# EAGLE schematic ControlBoard00_v04_NewNetNamesNewBackplanes (EAGLE 7.7.0), part 1 of 2

## Sheet 1 of 9: RPi Zero 2 W
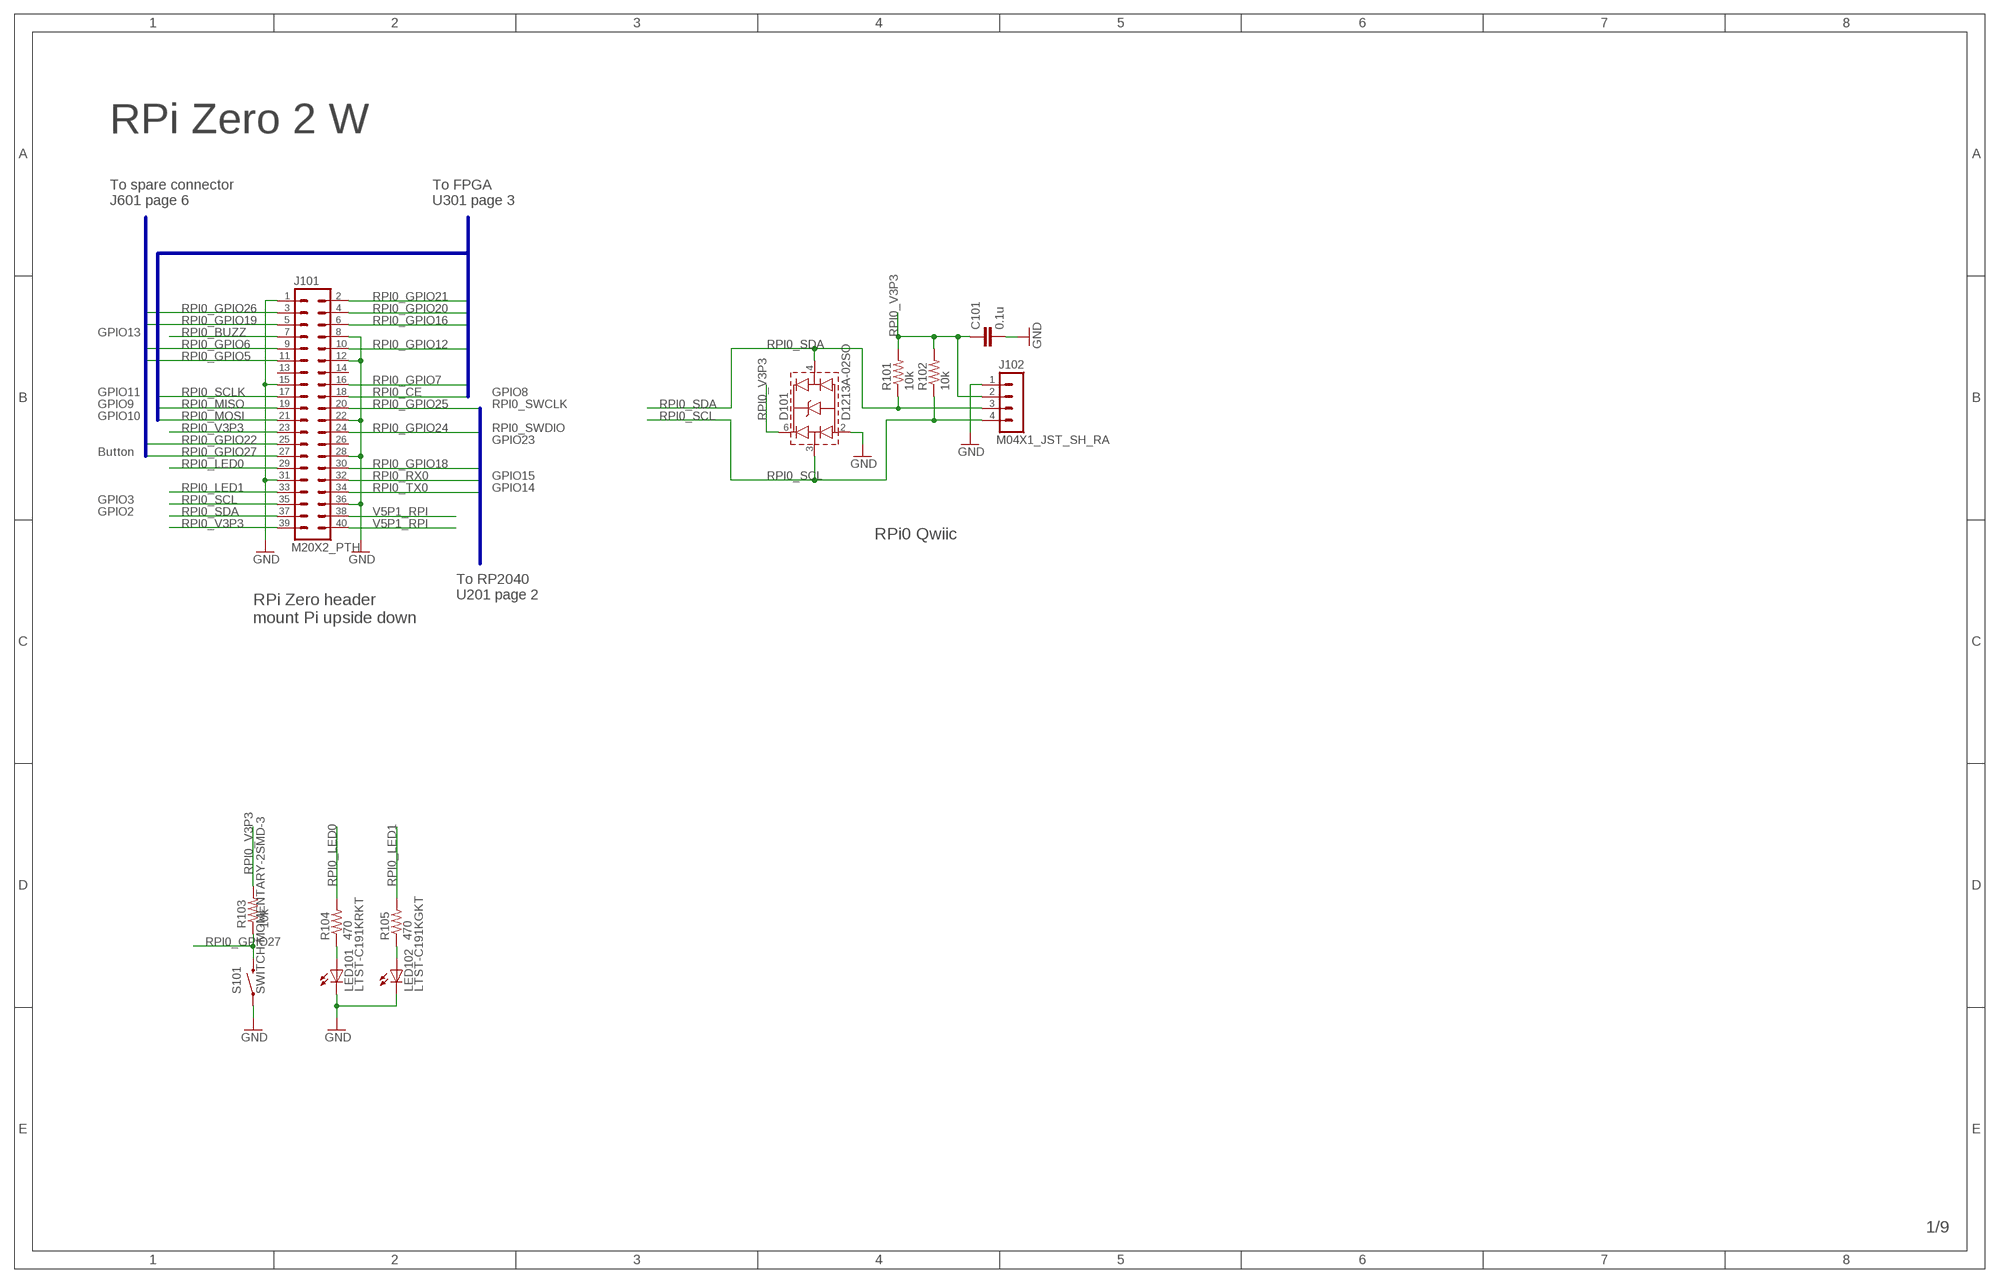
[diagram p0: schematic, sheet 1]

### Parts
C101  0.1u  CAP0402-CAP  [0402-CAP]
D101  D1213A-02SO  [SOT23-6]
J101  M20X2_PTH  [M20X2_PTH]
J102  M04X1_JST_SH_RA  [M04X1_JST_SH_SM_RA]
LED101  LTST-C191KRKT  LED0603  [LED-0603]
LED102  LTST-C191KGKT  LED0603  [LED-0603]
R101  10k  RESISTOR0402-RES  [0402-RES]
R102  10k  RESISTOR0402-RES  [0402-RES]
R103  10k  RESISTOR0402-RES  [0402-RES]
R104  470  RESISTOR0402-RES  [0402-RES]
R105  470  RESISTOR0402-RES  [0402-RES]
S101  SWITCH-MOMENTARY-2SMD-3  [TACTILE_SWITCH_SMD-3]

### Nets
GND: C101.2 D101.2(VN) J101.1 J101.8 J101.12 J101.15 J101.22 J101.28 J101.31 J101.36 J102.1 LED101.C LED102.C S101.1 ; also sheet 2,3,4,5,6,7,8,9
N$86: LED101.A R104.1
N$88: LED102.A R105.1
RPI0_BUZZ: J101.7 ; also sheet 6
RPI0_CE: J101.18 ; also sheet 3
RPI0_GPIO5: J101.11 ; also sheet 6
RPI0_GPIO6: J101.9 ; also sheet 6
RPI0_GPIO7: J101.16 ; also sheet 3
RPI0_GPIO12: J101.10 ; also sheet 3
RPI0_GPIO16: J101.6 ; also sheet 3
RPI0_GPIO18: J101.30 ; also sheet 2
RPI0_GPIO19: J101.5 ; also sheet 6
RPI0_GPIO20: J101.4 ; also sheet 3
RPI0_GPIO21: J101.2 ; also sheet 3
RPI0_GPIO22: J101.25 ; also sheet 6
RPI0_GPIO24: J101.24 ; also sheet 2
RPI0_GPIO25: J101.20 ; also sheet 2
RPI0_GPIO26: J101.3 ; also sheet 6
RPI0_GPIO27: J101.27 R103.1 S101.4 ; also sheet 6
RPI0_LED0: J101.29 R104.2
RPI0_LED1: J101.33 R105.2
RPI0_MISO: J101.19 ; also sheet 3
RPI0_MOSI: J101.21 ; also sheet 3
RPI0_RX0: J101.32 ; also sheet 2
RPI0_SCL: D101.3(CH1) J101.35 J102.4 R102.1 ; also sheet 3
RPI0_SCLK: J101.17 ; also sheet 3
RPI0_SDA: D101.4(CH2) J101.37 J102.3 R101.1 ; also sheet 3
RPI0_TX0: J101.34 ; also sheet 2
RPI0_V3P3: C101.1 D101.6(VP) J101.23 J101.39 J102.2 R101.2 R102.2 R103.2
V5P1_RPI: J101.38 J101.40 ; also sheet 7
Unconnected: J101.13 J101.14 J101.26

### Buses
RPI0_GPIO7,RPI0_GPIO12,RPI0_GPIO16,RPI0_GPIO20,RPI0_GPIO21,RPI0_SCLK,RPI0_MISO,RPI0_MOSI,RPI0_CE
RPI0_GPIO18,RPI0_GPIO24,RPI0_GPIO25,RPI0_RX0,RPI0_TX0
RPI0_GPIO5,RPI0_GPIO6,RPI0_GPIO19,RPI0_GPIO22,RPI0_GPIO26,RPI0_GPIO27

### Notes on the sheet
- RPi Zero 2 W
- To spare connector
  J601 page 6
- To FPGA
  U301 page 3
- GPIO13
- GPIO11 | GPIO8
- GPIO9 | RPI0_SWCLK
- GPIO10
- RPI0_SWDIO
- GPIO23
- Button
- GPIO15
- GPIO14
- GPIO3
- GPIO2
- RPi0 Qwiic
- To RP2040
  U201 page 2
- RPi Zero header
  mount Pi upside down

## Sheet 2 of 9: RP2040 MCU
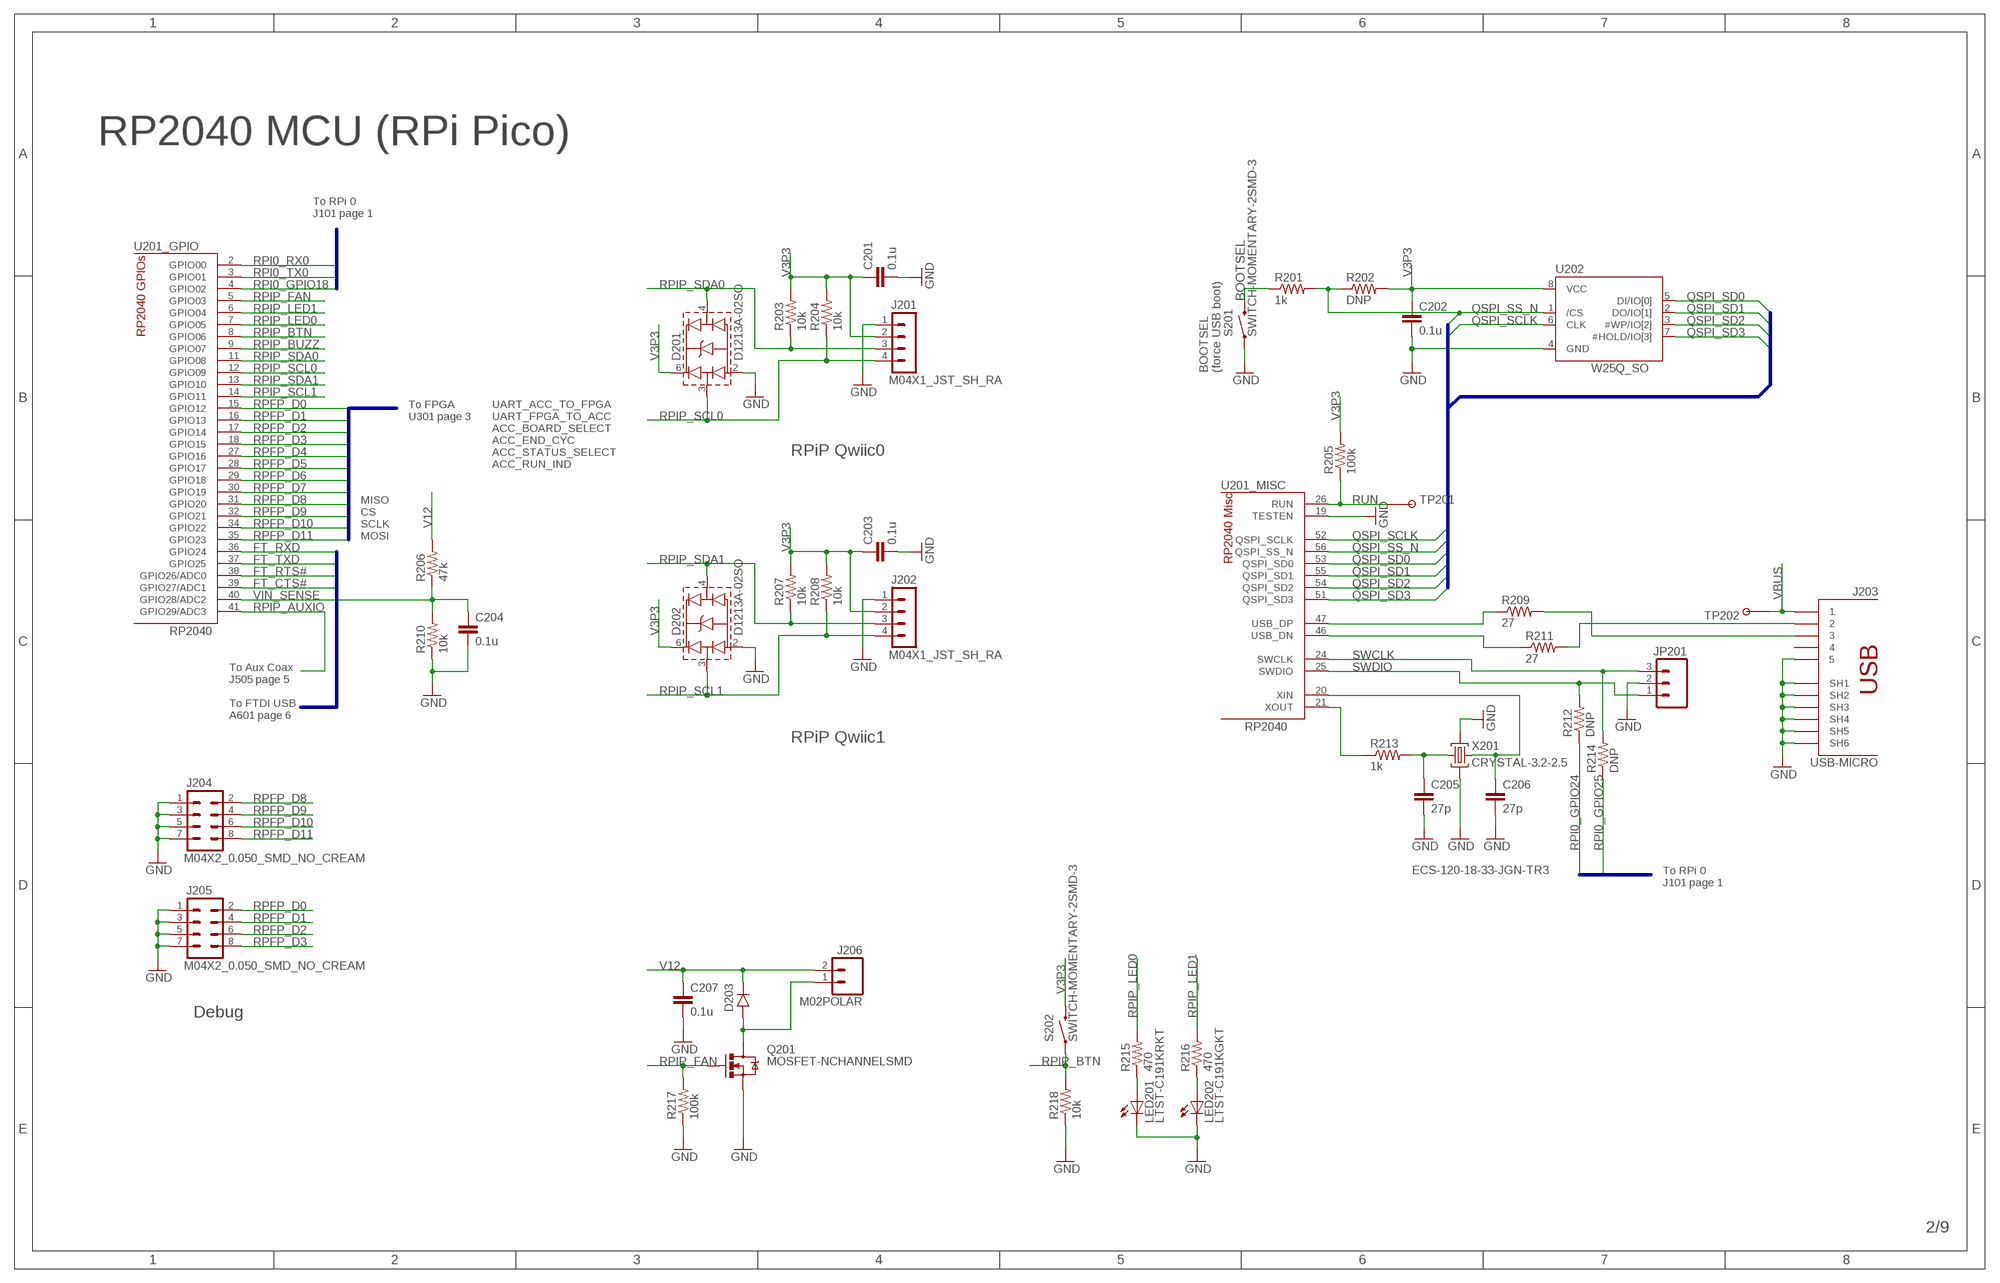
[diagram p1: schematic, sheet 2]

### Parts
C201  0.1u  CAP0402-CAP  [0402-CAP]
C202  0.1u  CAP0402-CAP  [0402-CAP]
C203  0.1u  CAP0402-CAP  [0402-CAP]
C204  0.1u  CAP0402-CAP  [0402-CAP]
C205  27p  CAP0402-CAP  [0402-CAP]
C206  27p  CAP0402-CAP  [0402-CAP]
C207  0.1u  CAP0402-CAP  [0402-CAP]
D201  D1213A-02SO  [SOT23-6]
D202  D1213A-02SO  [SOT23-6]
D203  DIODESOD123  [SOD123]
J201  M04X1_JST_SH_RA  [M04X1_JST_SH_SM_RA]
J202  M04X1_JST_SH_RA  [M04X1_JST_SH_SM_RA]
J203  USB-MICRO  [USB-MICRO]
J204  M04X2_0.050_SMD_NO_CREAM  [M04X2_0.050_SMD_NO_CREAM]
J205  M04X2_0.050_SMD_NO_CREAM  [M04X2_0.050_SMD_NO_CREAM]
J206  M02POLAR  [MOLEX-1X2]
JP201  M03POLAR  [MOLEX-1X3]
LED201  LTST-C191KRKT  LED0603  [LED-0603]
LED202  LTST-C191KGKT  LED0603  [LED-0603]
Q201  MOSFET-NCHANNELSMD  [SOT23-3]
R201  1k  RESISTOR0402-RES  [0402-RES]
R202  DNP  RESISTOR0402-RES  [0402-RES]
R203  10k  RESISTOR0402-RES  [0402-RES]
R204  10k  RESISTOR0402-RES  [0402-RES]
R205  100k  RESISTOR0402-RES  [0402-RES]
R206  47k  RESISTOR0402-RES  [0402-RES]
R207  10k  RESISTOR0402-RES  [0402-RES]
R208  10k  RESISTOR0402-RES  [0402-RES]
R209  27  RESISTOR0402-RES  [0402-RES]
R210  10k  RESISTOR0402-RES  [0402-RES]
R211  27  RESISTOR0402-RES  [0402-RES]
R212  DNP  RESISTOR0402-RES  [0402-RES]
R213  1k  RESISTOR0402-RES  [0402-RES]
R214  DNP  RESISTOR0402-RES  [0402-RES]
R215  470  RESISTOR0402-RES  [0402-RES]
R216  470  RESISTOR0402-RES  [0402-RES]
R217  100k  RESISTOR0402-RES  [0402-RES]
R218  10k  RESISTOR0402-RES  [0402-RES]
S201  SWITCH-MOMENTARY-2SMD-3  [TACTILE_SWITCH_SMD-3]
S202  SWITCH-MOMENTARY-2SMD-3  [TACTILE_SWITCH_SMD-3]
TP201  TESTPOINT_ROUND  [TESTPAD_ROUND]
TP202  TESTPOINT_ROUND  [TESTPAD_ROUND]
U201  RP2040  [QFN-56_EP]
U202  W25Q_SO  [SO08-208MIL]
X201  CRYSTAL-3.2-2.5  [CRYSTAL-3.2-2.5]

### Nets
BOOTSEL: R201.1 S201.4
FT_CTS#: U201.39(_GPIO:GPIO27/ADC1) ; also sheet 6
FT_RTS#: U201.38(_GPIO:GPIO26/ADC0) ; also sheet 6
FT_RXD: U201.36(_GPIO:GPIO24) ; also sheet 6
FT_TXD: U201.37(_GPIO:GPIO25) ; also sheet 6
GND: C201.2 C202.2 C203.2 C204.2 C205.2 C206.2 C207.2 D201.2(VN) D202.2(VN) J201.1 J202.1 J203.5 J203.SH1 J203.SH2 J203.SH3 J203.SH4 J203.SH5 J203.SH6 J204.1 J204.3 J204.5 J204.7 J205.1 J205.3 J205.5 J205.7 JP201.2 LED201.C LED202.C Q201.2(S) R210.1 R217.1 R218.1 S201.1 U201.19(_MISC:TESTEN) U202.4(GND) X201.2(GND) X201.4(GND) ; also sheet 1,3,4,5,6,7,8,9
N$16: C206.1 U201.20(_MISC:XIN) X201.3(C2)
N$17: C205.1 R213.2 X201.1(C1)
N$18: R213.1 U201.21(_MISC:XOUT)
N$29: R209.1 U201.47(_MISC:USB_DP)
N$30: R211.1 U201.46(_MISC:USB_DN)
N$35: J203.2 R211.2
N$37: J203.3 R209.2
N$85: LED202.A R216.1
N$91: LED201.A R215.1
N$92: D203.A J206.1 Q201.3(D)
QSPI_SCLK: U201.52(_MISC:QSPI_SCLK) U202.6(CLK)
QSPI_SD0: U201.53(_MISC:QSPI_SD0) U202.5(DI/IO[0])
QSPI_SD1: U201.55(_MISC:QSPI_SD1) U202.2(DO/IO[1])
QSPI_SD2: U201.54(_MISC:QSPI_SD2) U202.3(#WP/IO[2])
QSPI_SD3: U201.51(_MISC:QSPI_SD3) U202.7(#HOLD/IO[3])
QSPI_SS_N: R201.2 R202.1 U201.56(_MISC:QSPI_SS_N) U202.1(/CS)
RPFP_D0: J205.2 U201.15(_GPIO:GPIO12) ; also sheet 3
RPFP_D1: J205.4 U201.16(_GPIO:GPIO13) ; also sheet 3
RPFP_D2: J205.6 U201.17(_GPIO:GPIO14) ; also sheet 3
RPFP_D3: J205.8 U201.18(_GPIO:GPIO15) ; also sheet 3
RPFP_D4: U201.27(_GPIO:GPIO16) ; also sheet 3
RPFP_D5: U201.28(_GPIO:GPIO17) ; also sheet 3
RPFP_D6: U201.29(_GPIO:GPIO18) ; also sheet 3
RPFP_D7: U201.30(_GPIO:GPIO19) ; also sheet 3
RPFP_D8: J204.2 U201.31(_GPIO:GPIO20) ; also sheet 3
RPFP_D9: J204.4 U201.32(_GPIO:GPIO21) ; also sheet 3
RPFP_D10: J204.6 U201.34(_GPIO:GPIO22) ; also sheet 3
RPFP_D11: J204.8 U201.35(_GPIO:GPIO23) ; also sheet 3
RPI0_GPIO18: U201.4(_GPIO:GPIO02) ; also sheet 1
RPI0_GPIO24: R212.1 ; also sheet 1
RPI0_GPIO25: R214.1 ; also sheet 1
RPI0_RX0: U201.2(_GPIO:GPIO00) ; also sheet 1
RPI0_TX0: U201.3(_GPIO:GPIO01) ; also sheet 1
RPIP_AUXIO: U201.41(_GPIO:GPIO29/ADC3) ; also sheet 5
RPIP_BTN: R218.2 S202.1 U201.8(_GPIO:GPIO06)
RPIP_BUZZ: U201.9(_GPIO:GPIO07) ; also sheet 6
RPIP_FAN: Q201.1(G) R217.2 U201.5(_GPIO:GPIO03)
RPIP_LED0: R215.2 U201.7(_GPIO:GPIO05)
RPIP_LED1: R216.2 U201.6(_GPIO:GPIO04)
RPIP_SCL0: D201.3(CH1) J201.4 R204.1 U201.12(_GPIO:GPIO09)
RPIP_SCL1: D202.3(CH1) J202.4 R208.1 U201.14(_GPIO:GPIO11) ; also sheet 6
RPIP_SDA0: D201.4(CH2) J201.3 R203.1 U201.11(_GPIO:GPIO08)
RPIP_SDA1: D202.4(CH2) J202.3 R207.1 U201.13(_GPIO:GPIO10) ; also sheet 6
RUN: R205.1 TP201.P$1 U201.26(_MISC:RUN)
SWCLK: JP201.3 R214.2 U201.24(_MISC:SWCLK)
SWDIO: JP201.1 R212.2 U201.25(_MISC:SWDIO)
V3P3: C201.1 C202.1 C203.1 D201.6(VP) D202.6(VP) J201.2 J202.2 R202.2 R203.2 R204.2 R205.2 R207.2 R208.2 S202.4 U202.8(VCC) ; also sheet 3,5,6,7,9
V12: C207.1 D203.C J206.2 R206.2 ; also sheet 6,7,8,9
VBUS: J203.1 TP202.P$1
VIN_SENSE: C204.1 R206.1 R210.2 U201.40(_GPIO:GPIO28/ADC2) ; also sheet 5
Unconnected: J203.4

### Buses
QSPI_SCLK,QSPI_SS_N,QSPI_SD[0..3]
RPI0_GPIO18,RPI0_GPIO24,RPI0_GPIO25,RPI0_RX0,RPI0_TX0
RPIP_GPIO[12..19],RPIP_MISO0,RPIP_MOSI0,RPIP_SCLK0,RPIP_CS0
FT_TXD,FT_RTS#,FT_CTS#,FT_RXD

### Notes on the sheet
- RP2040 MCU (RPi Pico)
- To RPi 0
  J101 page 1
- BOOTSEL
  (force USB boot)
- UART_ACC_TO_FPGA
- To FPGA
  U301 page 3
- UART_FPGA_TO_ACC
- ACC_BOARD_SELECT
- ACC_END_CYC
- ACC_STATUS_SELECT | RPiP Qwiic0
- ACC_RUN_IND
- MISO
- CS
- SCLK
- MOSI
- To Aux Coax
  J505 page 5
- To FTDI USB
  A601 page 6
- RPiP Qwiic1
- ECS-120-18-33-JGN-TR3
- To RPi 0
  J101 page 1
- Debug

## Sheet 3 of 9: FPGA
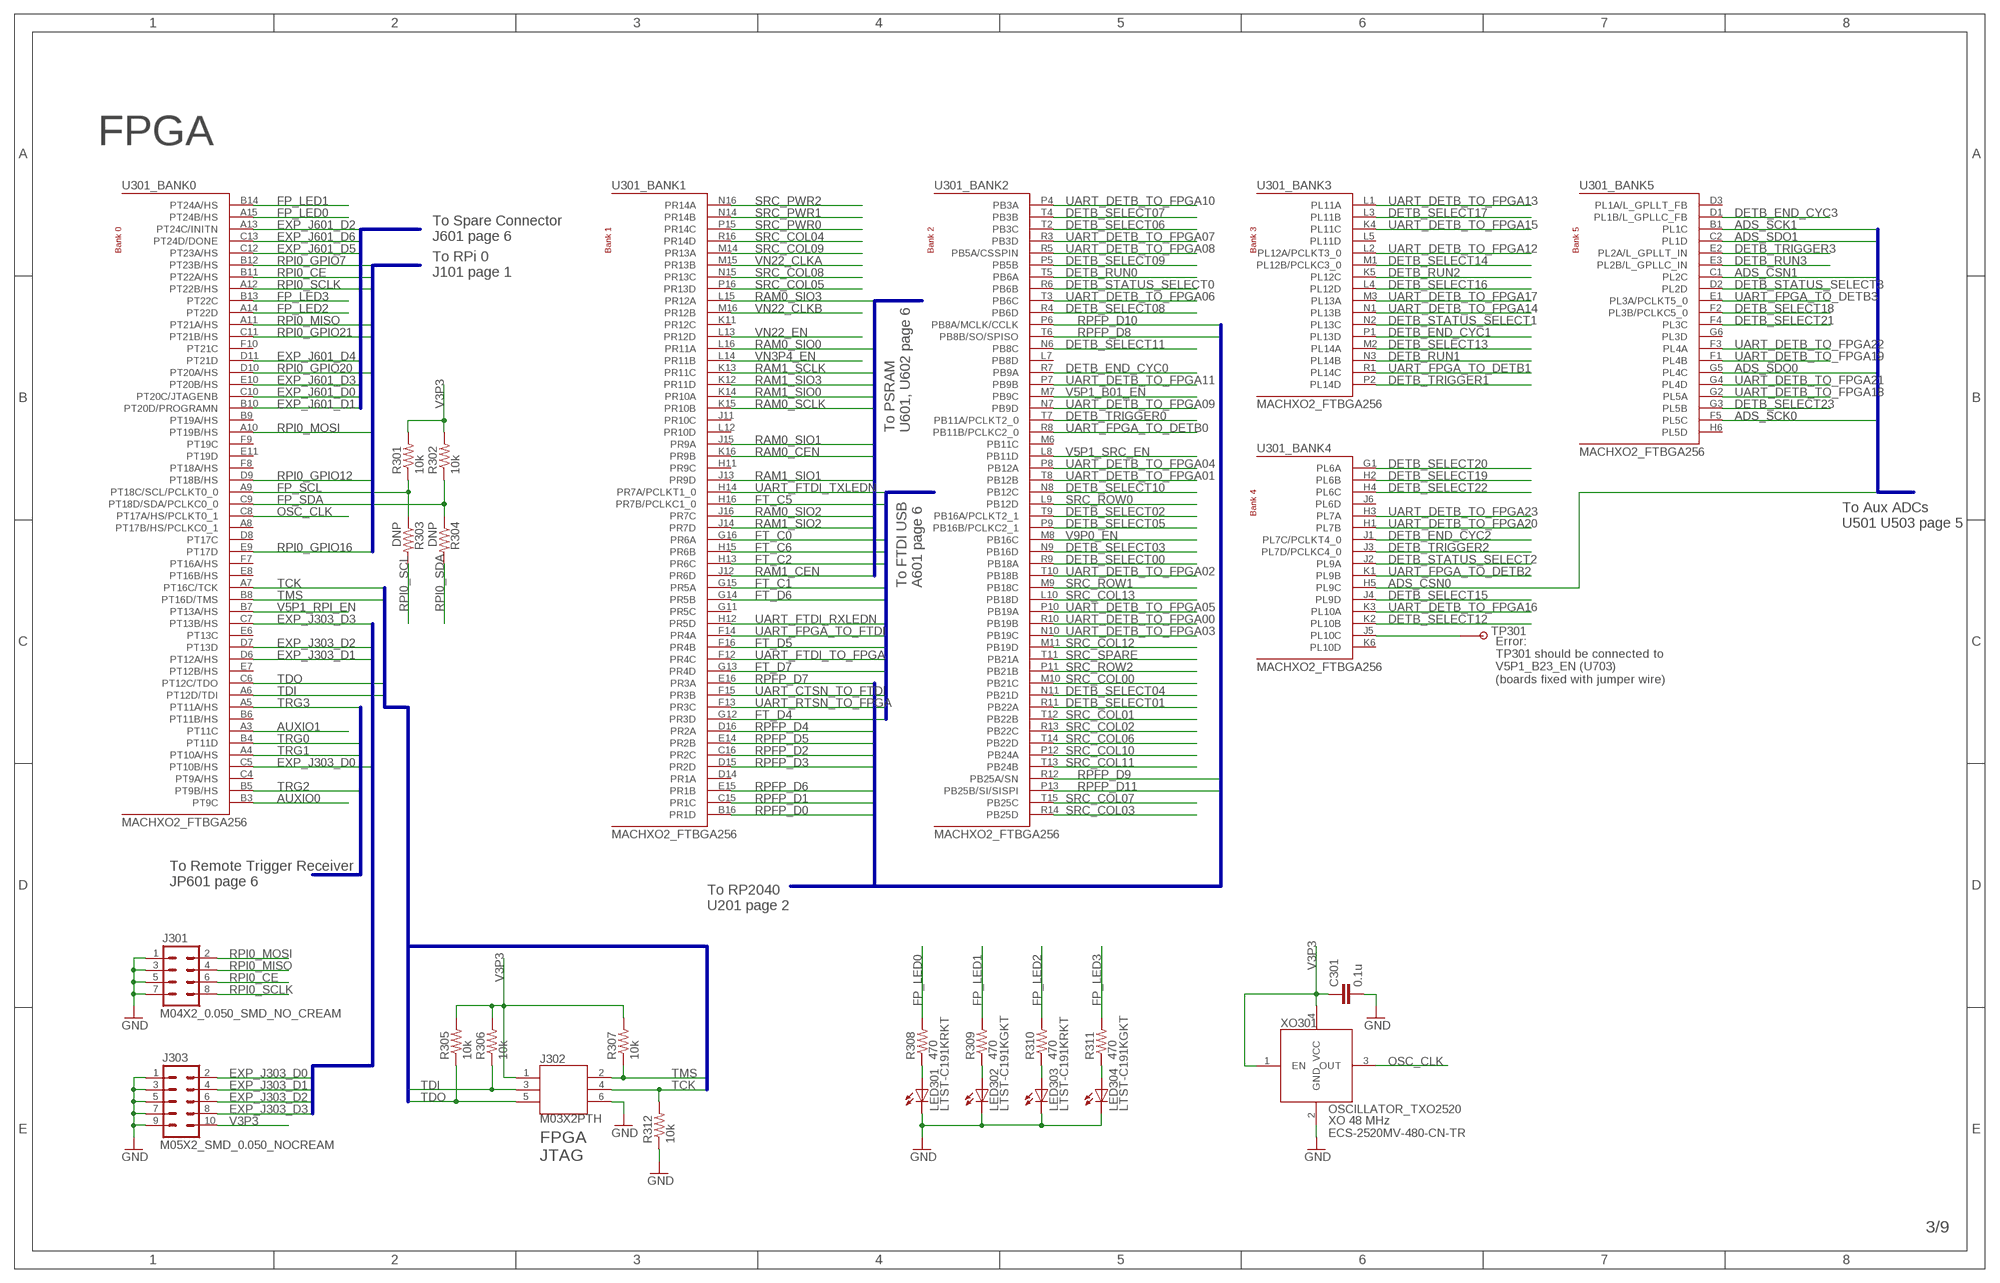
[diagram p2: schematic, sheet 3]

### Parts
C301  0.1u  CAP0402-CAP  [0402-CAP]
J301  M04X2_0.050_SMD_NO_CREAM  [M04X2_0.050_SMD_NO_CREAM]
J302  M03X2PTH  [2X3-NS]
J303  M05X2_SMD_0.050_NOCREAM  [M05X2_0.050_SMD_NO_CREAM]
LED301  LTST-C191KRKT  LED0603  [LED-0603]
LED302  LTST-C191KGKT  LED0603  [LED-0603]
LED303  LTST-C191KRKT  LED0603  [LED-0603]
LED304  LTST-C191KGKT  LED0603  [LED-0603]
R301  10k  RESISTOR0402-RES  [0402-RES]
R302  10k  RESISTOR0402-RES  [0402-RES]
R303  DNP  RESISTOR0402-RES  [0402-RES]
R304  DNP  RESISTOR0402-RES  [0402-RES]
R305  10k  RESISTOR0402-RES  [0402-RES]
R306  10k  RESISTOR0402-RES  [0402-RES]
R307  10k  RESISTOR0402-RES  [0402-RES]
R308  470  RESISTOR0402-RES  [0402-RES]
R309  470  RESISTOR0402-RES  [0402-RES]
R310  470  RESISTOR0402-RES  [0402-RES]
R311  470  RESISTOR0402-RES  [0402-RES]
R312  10k  RESISTOR0402-RES  [0402-RES]
TP301  TESTPOINT_ROUND  [TESTPAD_ROUND]
U301  MACHXO2_FTBGA256  [LBGA-256]
XO301  OSCILLATOR_TXO2520  [TXO2520]

### Nets
ADS_CSN0: U301.H5(_BANK4:PL9C) ; also sheet 5
ADS_CSN1: U301.C1(_BANK5:PL2C) ; also sheet 5
ADS_SCK0: U301.F5(_BANK5:PL5C) ; also sheet 5
ADS_SCK1: U301.B1(_BANK5:PL1C) ; also sheet 5
ADS_SDO0: U301.G5(_BANK5:PL4C) ; also sheet 5
ADS_SDO1: U301.C2(_BANK5:PL1D) ; also sheet 5
AUXIO0: U301.B3(_BANK0:PT9C) ; also sheet 5
AUXIO1: U301.A3(_BANK0:PT11C) ; also sheet 5
DETB_END_CYC0: U301.R7(_BANK2:PB9A) ; also sheet 4
DETB_END_CYC1: U301.P1(_BANK3:PL13D) ; also sheet 4
DETB_END_CYC2: U301.J1(_BANK4:PL7C/PCLKT4_0) ; also sheet 4
DETB_END_CYC3: U301.D1(_BANK5:PL1B/L_GPLLC_FB) ; also sheet 4
DETB_RUN0: U301.T5(_BANK2:PB6A) ; also sheet 4
DETB_RUN1: U301.N3(_BANK3:PL14B) ; also sheet 4
DETB_RUN2: U301.K5(_BANK3:PL12C) ; also sheet 4
DETB_RUN3: U301.E3(_BANK5:PL2B/L_GPLLC_IN) ; also sheet 4
DETB_SELECT00: U301.R9(_BANK2:PB18A) ; also sheet 4
DETB_SELECT01: U301.R11(_BANK2:PB22A) ; also sheet 4
DETB_SELECT02: U301.T9(_BANK2:PB16A/PCLKT2_1) ; also sheet 4
DETB_SELECT03: U301.N9(_BANK2:PB16D) ; also sheet 4
DETB_SELECT04: U301.N11(_BANK2:PB21D) ; also sheet 4
DETB_SELECT05: U301.P9(_BANK2:PB16B/PCLKC2_1) ; also sheet 4
DETB_SELECT06: U301.T2(_BANK2:PB3C) ; also sheet 4
DETB_SELECT07: U301.T4(_BANK2:PB3B) ; also sheet 4
DETB_SELECT08: U301.R4(_BANK2:PB6D) ; also sheet 4
DETB_SELECT09: U301.P5(_BANK2:PB5B) ; also sheet 4
DETB_SELECT10: U301.N8(_BANK2:PB12C) ; also sheet 4
DETB_SELECT11: U301.N6(_BANK2:PB8C) ; also sheet 4
DETB_SELECT12: U301.K2(_BANK4:PL10B) ; also sheet 4
DETB_SELECT13: U301.M2(_BANK3:PL14A) ; also sheet 4
DETB_SELECT14: U301.M1(_BANK3:PL12B/PCLKC3_0) ; also sheet 4
DETB_SELECT15: U301.J4(_BANK4:PL9D) ; also sheet 4
DETB_SELECT16: U301.L4(_BANK3:PL12D) ; also sheet 4
DETB_SELECT17: U301.L3(_BANK3:PL11B) ; also sheet 4
DETB_SELECT18: U301.F2(_BANK5:PL3B/PCLKC5_0) ; also sheet 4
DETB_SELECT19: U301.H2(_BANK4:PL6B) ; also sheet 4
DETB_SELECT20: U301.G1(_BANK4:PL6A) ; also sheet 4
DETB_SELECT21: U301.F4(_BANK5:PL3C) ; also sheet 4
DETB_SELECT22: U301.H4(_BANK4:PL6C) ; also sheet 4
DETB_SELECT23: U301.G3(_BANK5:PL5B) ; also sheet 4
DETB_STATUS_SELECT0: U301.R6(_BANK2:PB6B) ; also sheet 4
DETB_STATUS_SELECT1: U301.N2(_BANK3:PL13C) ; also sheet 4
DETB_STATUS_SELECT2: U301.J2(_BANK4:PL9A) ; also sheet 4
DETB_STATUS_SELECT3: U301.D2(_BANK5:PL2D) ; also sheet 4
DETB_TRIGGER0: U301.T7(_BANK2:PB11A/PCLKT2_0) ; also sheet 4
DETB_TRIGGER1: U301.P2(_BANK3:PL14D) ; also sheet 4
DETB_TRIGGER2: U301.J3(_BANK4:PL7D/PCLKC4_0) ; also sheet 4
DETB_TRIGGER3: U301.E2(_BANK5:PL2A/L_GPLLT_IN) ; also sheet 4
EXP_J303_D0: J303.2 U301.C5(_BANK0:PT10B/HS)
EXP_J303_D1: J303.4 U301.D6(_BANK0:PT12A/HS)
EXP_J303_D2: J303.6 U301.D7(_BANK0:PT13D)
EXP_J303_D3: J303.8 U301.C7(_BANK0:PT13B/HS)
EXP_J601_D0: U301.C10(_BANK0:PT20C/JTAGENB) ; also sheet 6
EXP_J601_D1: U301.B10(_BANK0:PT20D/PROGRAMN) ; also sheet 6
EXP_J601_D2: U301.A13(_BANK0:PT24C/INITN) ; also sheet 6
EXP_J601_D3: U301.E10(_BANK0:PT20B/HS) ; also sheet 6
EXP_J601_D4: U301.D11(_BANK0:PT21D) ; also sheet 6
EXP_J601_D5: U301.C12(_BANK0:PT23A/HS) ; also sheet 6
EXP_J601_D6: U301.C13(_BANK0:PT24D/DONE) ; also sheet 6
FP_LED0: R308.2 U301.A15(_BANK0:PT24B/HS)
FP_LED1: R309.2 U301.B14(_BANK0:PT24A/HS)
FP_LED2: R310.2 U301.A14(_BANK0:PT22D)
FP_LED3: R311.2 U301.B13(_BANK0:PT22C)
FP_SCL: R301.1 R303.1 U301.A9(_BANK0:PT18C/SCL/PCLKT0_0)
FP_SDA: R302.1 R304.1 U301.C9(_BANK0:PT18D/SDA/PCLKC0_0)
FT_C0: U301.G16(_BANK1:PR6A) ; also sheet 6
FT_C1: U301.G15(_BANK1:PR5A) ; also sheet 6
FT_C2: U301.H13(_BANK1:PR6C) ; also sheet 6
FT_C5: U301.H16(_BANK1:PR7B/PCLKC1_0) ; also sheet 6
FT_C6: U301.H15(_BANK1:PR6B) ; also sheet 6
FT_D4: U301.G12(_BANK1:PR3D) ; also sheet 6
FT_D5: U301.F16(_BANK1:PR4B) ; also sheet 6
FT_D6: U301.G14(_BANK1:PR5B) ; also sheet 6
FT_D7: U301.G13(_BANK1:PR4D) ; also sheet 6
GND: C301.2 J301.1 J301.3 J301.5 J301.7 J302.6 J303.1 J303.3 J303.5 J303.7 J303.9 LED301.C LED302.C LED303.C LED304.C R312.1 XO301.2(GND) ; also sheet 1,2,4,5,6,7,8,9
N$55: LED301.A R308.1
N$56: LED302.A R309.1
N$57: LED303.A R310.1
N$58: LED304.A R311.1
OSC_CLK: U301.C8(_BANK0:PT17A/HS/PCLKT0_1) XO301.3(OUT)
RAM0_CEN: U301.K16(_BANK1:PR9B) ; also sheet 6
RAM0_SCLK: U301.K15(_BANK1:PR10B) ; also sheet 6
RAM0_SIO0: U301.L16(_BANK1:PR11A) ; also sheet 6
RAM0_SIO1: U301.J15(_BANK1:PR9A) ; also sheet 6
RAM0_SIO2: U301.J16(_BANK1:PR7C) ; also sheet 6
RAM0_SIO3: U301.L15(_BANK1:PR12A) ; also sheet 6
RAM1_CEN: U301.J12(_BANK1:PR6D) ; also sheet 6
RAM1_SCLK: U301.K13(_BANK1:PR11C) ; also sheet 6
RAM1_SIO0: U301.K14(_BANK1:PR10A) ; also sheet 6
RAM1_SIO1: U301.J13(_BANK1:PR9D) ; also sheet 6
RAM1_SIO2: U301.J14(_BANK1:PR7D) ; also sheet 6
RAM1_SIO3: U301.K12(_BANK1:PR11D) ; also sheet 6
RPFP_D0: U301.B16(_BANK1:PR1D) ; also sheet 2
RPFP_D1: U301.C15(_BANK1:PR1C) ; also sheet 2
RPFP_D2: U301.C16(_BANK1:PR2C) ; also sheet 2
RPFP_D3: U301.D15(_BANK1:PR2D) ; also sheet 2
RPFP_D4: U301.D16(_BANK1:PR2A) ; also sheet 2
RPFP_D5: U301.E14(_BANK1:PR2B) ; also sheet 2
RPFP_D6: U301.E15(_BANK1:PR1B) ; also sheet 2
RPFP_D7: U301.E16(_BANK1:PR3A) ; also sheet 2
RPFP_D8: U301.T6(_BANK2:PB8B/SO/SPISO) ; also sheet 2
RPFP_D9: U301.R12(_BANK2:PB25A/SN) ; also sheet 2
RPFP_D10: U301.P6(_BANK2:PB8A/MCLK/CCLK) ; also sheet 2
RPFP_D11: U301.P13(_BANK2:PB25B/SI/SISPI) ; also sheet 2
RPI0_CE: J301.6 U301.B11(_BANK0:PT22A/HS) ; also sheet 1
RPI0_GPIO7: U301.B12(_BANK0:PT23B/HS) ; also sheet 1
RPI0_GPIO12: U301.D9(_BANK0:PT18B/HS) ; also sheet 1
RPI0_GPIO16: U301.E9(_BANK0:PT17D) ; also sheet 1
RPI0_GPIO20: U301.D10(_BANK0:PT20A/HS) ; also sheet 1
RPI0_GPIO21: U301.C11(_BANK0:PT21B/HS) ; also sheet 1
RPI0_MISO: J301.4 U301.A11(_BANK0:PT21A/HS) ; also sheet 1
RPI0_MOSI: J301.2 U301.A10(_BANK0:PT19B/HS) ; also sheet 1
RPI0_SCL: R303.2 ; also sheet 1
RPI0_SCLK: J301.8 U301.A12(_BANK0:PT22B/HS) ; also sheet 1
RPI0_SDA: R304.2 ; also sheet 1
SRC_COL00: U301.M10(_BANK2:PB21C) ; also sheet 4
SRC_COL01: U301.T12(_BANK2:PB22B) ; also sheet 4
SRC_COL02: U301.R13(_BANK2:PB22C) ; also sheet 4
SRC_COL03: U301.R14(_BANK2:PB25D) ; also sheet 4
SRC_COL04: U301.R16(_BANK1:PR14D) ; also sheet 4
SRC_COL05: U301.P16(_BANK1:PR13D) ; also sheet 4
SRC_COL06: U301.T14(_BANK2:PB22D) ; also sheet 4
SRC_COL07: U301.T15(_BANK2:PB25C) ; also sheet 4
SRC_COL08: U301.N15(_BANK1:PR13C) ; also sheet 4
SRC_COL09: U301.M14(_BANK1:PR13A) ; also sheet 4
SRC_COL10: U301.P12(_BANK2:PB24A) ; also sheet 4
SRC_COL11: U301.T13(_BANK2:PB24B) ; also sheet 4
SRC_COL12: U301.M11(_BANK2:PB19D) ; also sheet 4
SRC_COL13: U301.L10(_BANK2:PB18D) ; also sheet 4
SRC_PWR0: U301.P15(_BANK1:PR14C) ; also sheet 4
SRC_PWR1: U301.N14(_BANK1:PR14B) ; also sheet 4
SRC_PWR2: U301.N16(_BANK1:PR14A) ; also sheet 4
SRC_ROW0: U301.L9(_BANK2:PB12D) ; also sheet 4
SRC_ROW1: U301.M9(_BANK2:PB18C) ; also sheet 4
SRC_ROW2: U301.P11(_BANK2:PB21B) ; also sheet 4
SRC_SPARE: U301.T11(_BANK2:PB21A) ; also sheet 4
TCK: J302.4 R312.2 U301.A7(_BANK0:PT16C/TCK)
TDI: J302.3 R306.1 U301.A6(_BANK0:PT12D/TDI)
TDO: J302.5 R305.1 U301.C6(_BANK0:PT12C/TDO)
TMS: J302.2 R307.1 U301.B8(_BANK0:PT16D/TMS)
TP301_NET: TP301.P$1 U301.J5(_BANK4:PL10C)
TRG0: U301.B4(_BANK0:PT11D) ; also sheet 6
TRG1: U301.A4(_BANK0:PT10A/HS) ; also sheet 6
TRG2: U301.B5(_BANK0:PT9B/HS) ; also sheet 6
TRG3: U301.A5(_BANK0:PT11A/HS) ; also sheet 6
UART_CTSN_TO_FTDI: U301.F15(_BANK1:PR3B) ; also sheet 6
UART_DETB_TO_FPGA00: U301.R10(_BANK2:PB19B) ; also sheet 4
UART_DETB_TO_FPGA01: U301.T8(_BANK2:PB12B) ; also sheet 4
UART_DETB_TO_FPGA02: U301.T10(_BANK2:PB18B) ; also sheet 4
UART_DETB_TO_FPGA03: U301.N10(_BANK2:PB19C) ; also sheet 4
UART_DETB_TO_FPGA04: U301.P8(_BANK2:PB12A) ; also sheet 4
UART_DETB_TO_FPGA05: U301.P10(_BANK2:PB19A) ; also sheet 4
UART_DETB_TO_FPGA06: U301.T3(_BANK2:PB6C) ; also sheet 4
UART_DETB_TO_FPGA07: U301.R3(_BANK2:PB3D) ; also sheet 4
UART_DETB_TO_FPGA08: U301.R5(_BANK2:PB5A/CSSPIN) ; also sheet 4
UART_DETB_TO_FPGA09: U301.N7(_BANK2:PB9D) ; also sheet 4
UART_DETB_TO_FPGA10: U301.P4(_BANK2:PB3A) ; also sheet 4
UART_DETB_TO_FPGA11: U301.P7(_BANK2:PB9B) ; also sheet 4
UART_DETB_TO_FPGA12: U301.L2(_BANK3:PL12A/PCLKT3_0) ; also sheet 4
UART_DETB_TO_FPGA13: U301.L1(_BANK3:PL11A) ; also sheet 4
UART_DETB_TO_FPGA14: U301.N1(_BANK3:PL13B) ; also sheet 4
UART_DETB_TO_FPGA15: U301.K4(_BANK3:PL11C) ; also sheet 4
UART_DETB_TO_FPGA16: U301.K3(_BANK4:PL10A) ; also sheet 4
UART_DETB_TO_FPGA17: U301.M3(_BANK3:PL13A) ; also sheet 4
UART_DETB_TO_FPGA18: U301.G2(_BANK5:PL5A) ; also sheet 4
UART_DETB_TO_FPGA19: U301.F1(_BANK5:PL4B) ; also sheet 4
UART_DETB_TO_FPGA20: U301.H1(_BANK4:PL7B) ; also sheet 4
UART_DETB_TO_FPGA21: U301.G4(_BANK5:PL4D) ; also sheet 4
UART_DETB_TO_FPGA22: U301.F3(_BANK5:PL4A) ; also sheet 4
UART_DETB_TO_FPGA23: U301.H3(_BANK4:PL7A) ; also sheet 4
UART_FPGA_TO_DETB0: U301.R8(_BANK2:PB11B/PCLKC2_0) ; also sheet 4
UART_FPGA_TO_DETB1: U301.R1(_BANK3:PL14C) ; also sheet 4
UART_FPGA_TO_DETB2: U301.K1(_BANK4:PL9B) ; also sheet 4
UART_FPGA_TO_DETB3: U301.E1(_BANK5:PL3A/PCLKT5_0) ; also sheet 4
UART_FPGA_TO_FTDI: U301.F14(_BANK1:PR4A) ; also sheet 6
UART_FTDI_RXLEDN: U301.H12(_BANK1:PR5D) ; also sheet 6
UART_FTDI_TO_FPGA: U301.F12(_BANK1:PR4C) ; also sheet 6
UART_FTDI_TXLEDN: U301.H14(_BANK1:PR7A/PCLKT1_0) ; also sheet 6
UART_RTSN_TO_FPGA: U301.F13(_BANK1:PR3C) ; also sheet 6
V3P3: C301.1 J302.1 J303.10 R301.2 R302.2 R305.2 R306.2 R307.2 XO301.1(EN) XO301.4(VCC) ; also sheet 2,5,6,7,9
V5P1_B01_EN: U301.M7(_BANK2:PB9C) ; also sheet 7
V5P1_RPI_EN: U301.B7(_BANK0:PT13A/HS) ; also sheet 7
V5P1_SRC_EN: U301.L8(_BANK2:PB11D) ; also sheet 7
V9P0_EN: U301.M8(_BANK2:PB16C) ; also sheet 9
VN3P4_EN: U301.L14(_BANK1:PR11B) ; also sheet 8
VN22_CLKA: U301.M15(_BANK1:PR13B) ; also sheet 8
VN22_CLKB: U301.M16(_BANK1:PR12B) ; also sheet 8
VN22_EN: U301.L13(_BANK1:PR12D) ; also sheet 8
Unconnected: U301.A8(_BANK0:PT17B/HS/PCLKC0_1) U301.B6(_BANK0:PT11B/HS) U301.B9(_BANK0:PT19A/HS) U301.C4(_BANK0:PT9A/HS) U301.D3(_BANK5:PL1A/L_GPLLT_FB) U301.D8(_BANK0:PT17C) U301.D14(_BANK1:PR1A) U301.E6(_BANK0:PT13C) U301.E7(_BANK0:PT12B/HS) U301.E8(_BANK0:PT16B/HS) U301.E11(_BANK0:PT19D) U301.F7(_BANK0:PT16A/HS) U301.F8(_BANK0:PT18A/HS) U301.F9(_BANK0:PT19C) U301.F10(_BANK0:PT21C) U301.G6(_BANK5:PL3D) U301.G11(_BANK1:PR5C) U301.H6(_BANK5:PL5D) U301.H11(_BANK1:PR9C) U301.J6(_BANK4:PL6D) U301.J11(_BANK1:PR10C) U301.K6(_BANK4:PL10D) U301.K11(_BANK1:PR12C) U301.L5(_BANK3:PL11D) U301.L7(_BANK2:PB8D) U301.L12(_BANK1:PR10D) U301.M6(_BANK2:PB11C)

### Buses
RPI0_GPIO7,RPI0_GPIO12,RPI0_GPIO16,RPI0_GPIO20,RPI0_GPIO21,RPI0_SCLK,RPI0_MISO,RPI0_MOSI,RPI0_CE
RPIP_GPIO[12..19],RPIP_MISO0,RPIP_MOSI0,RPIP_SCLK0,RPIP_CS0
FT_D[0..7],FT_DXF#,FT_TXE#,FT_RD#,FT_WR#,FT_SIWUA,FT_CLKOUT,FT_OE#
FP_C5,FP_C7,FP_D6,FP_D7
JTAGENB,PROGRAMN,INITN,FP_E10,FP_D11,FP_C12,DONE
TRG[0..3]
TDI,TDO,TCK,TMS
ADS_CS#[0..1],ADS_SDO#[0..1],ADS_SCLK#[0..1]
RAM0_SIO[0..3],RAM0_/CE,RAM0_SCLK,RAM1_SIO[0..3],RAM1_/CE,RAM1_SCLK

### Notes on the sheet
- FPGA
- To Spare Connector
  J601 page 6
- To RPi 0
  J101 page 1
- To PSRAM
  U601, U602 page 6
- To Aux ADCs
  U501 U503 page 5
- To FTDI USB
  A601 page 6
- Error:
  TP301 should be connected to
  V5P1_B23_EN (U703)
  (boards fixed with jumper wire)
- To Remote Trigger Receiver
  JP601 page 6
- To RP2040
  U201 page 2
- XO 48 MHz
  ECS-2520MV-480-CN-TR
- FPGA
  JTAG

## Sheet 4 of 9: Backplanes
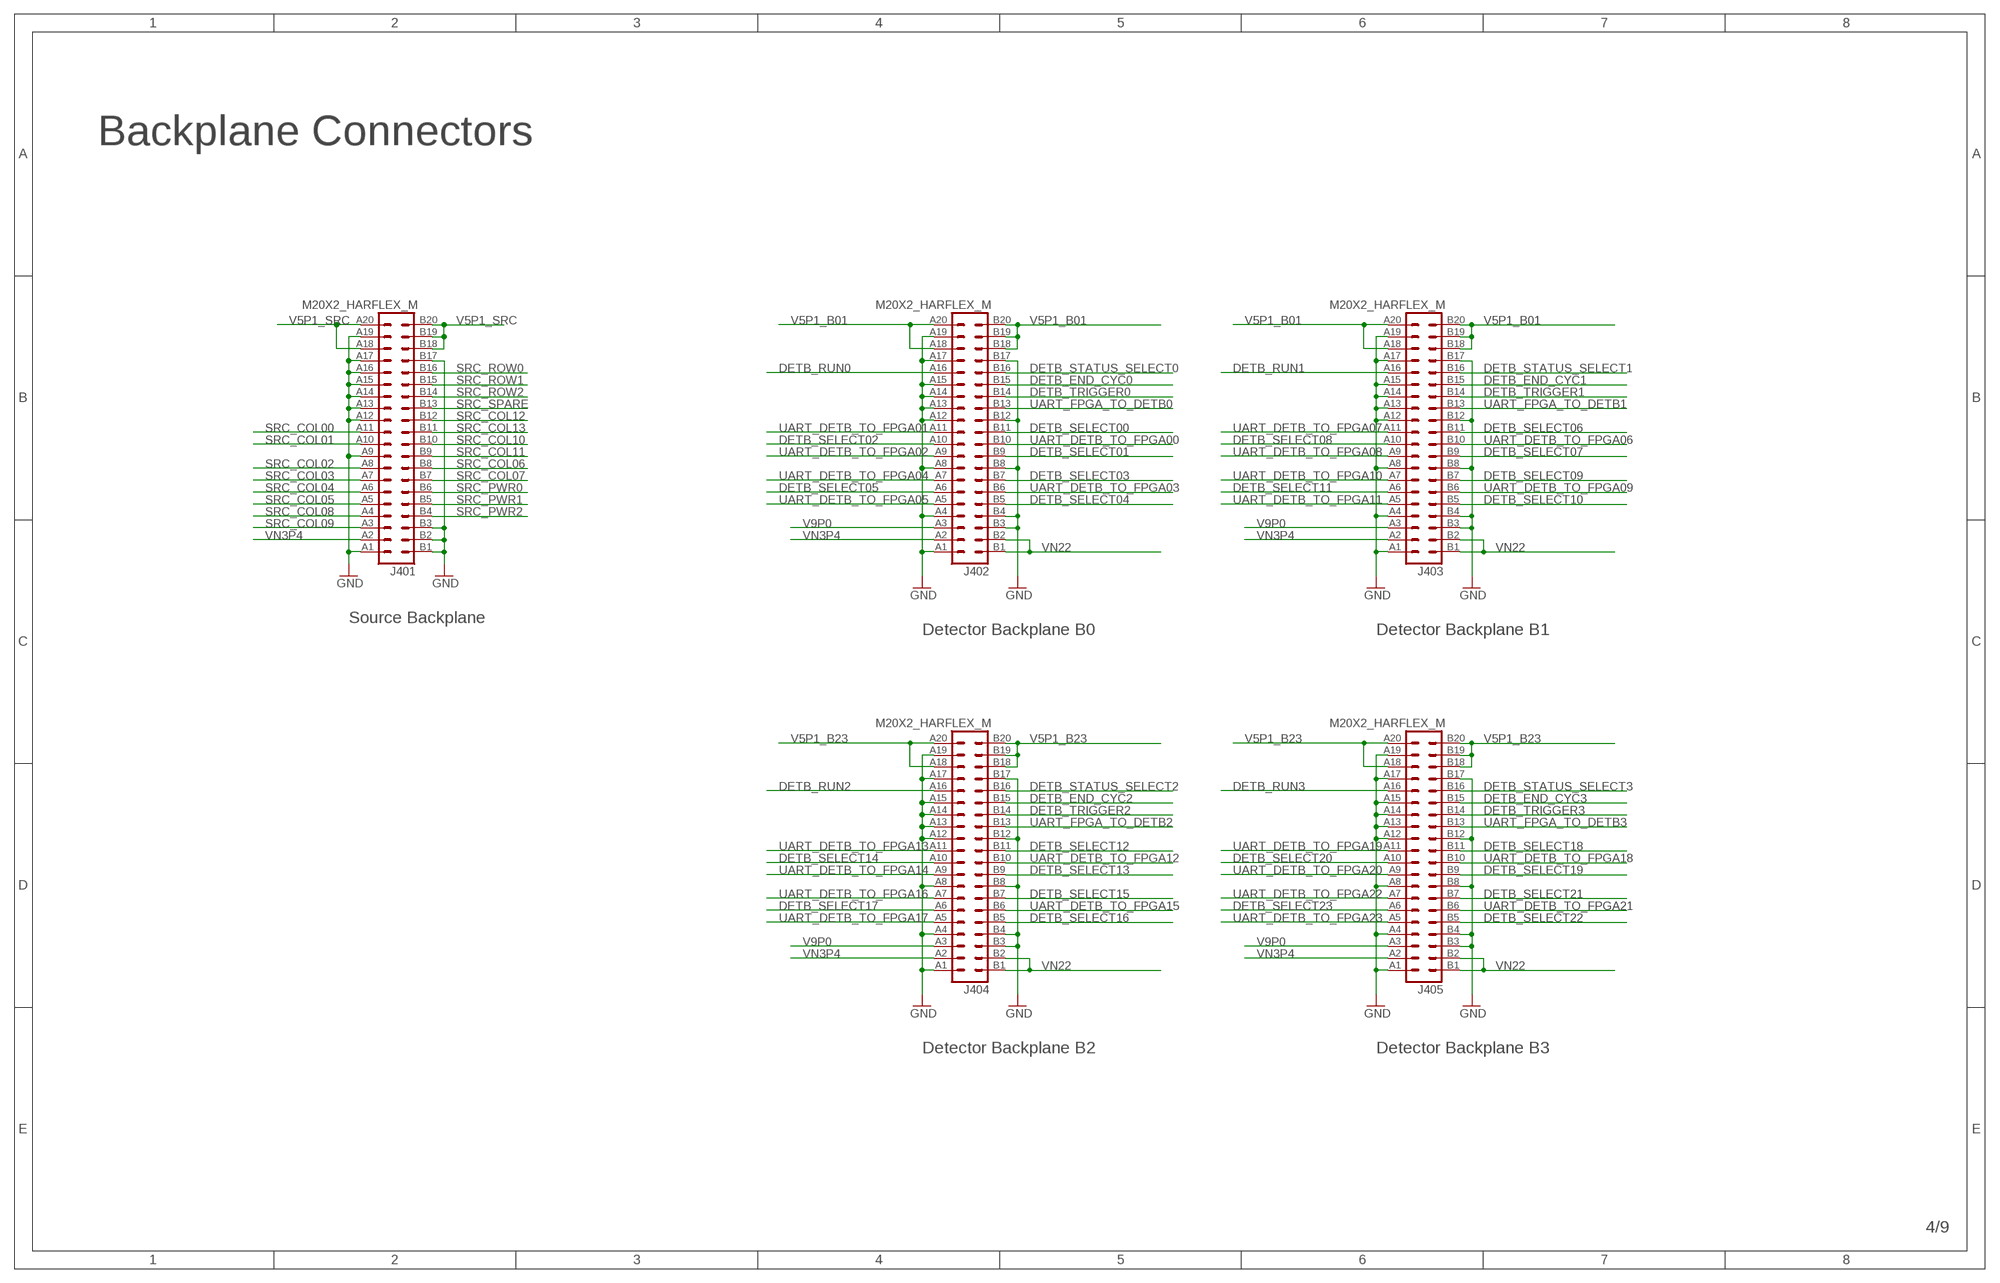
[diagram p3: schematic, sheet 4]

### Parts
J401  M20X2_HARFLEX_M  [M20X2_HARFLEX_M]
J402  M20X2_HARFLEX_M  [M20X2_HARFLEX_M]
J403  M20X2_HARFLEX_M  [M20X2_HARFLEX_M]
J404  M20X2_HARFLEX_M  [M20X2_HARFLEX_M]
J405  M20X2_HARFLEX_M  [M20X2_HARFLEX_M]

### Nets
DETB_END_CYC0: J402.B15 ; also sheet 3
DETB_END_CYC1: J403.B15 ; also sheet 3
DETB_END_CYC2: J404.B15 ; also sheet 3
DETB_END_CYC3: J405.B15 ; also sheet 3
DETB_RUN0: J402.A16 ; also sheet 3
DETB_RUN1: J403.A16 ; also sheet 3
DETB_RUN2: J404.A16 ; also sheet 3
DETB_RUN3: J405.A16 ; also sheet 3
DETB_SELECT00: J402.B11 ; also sheet 3
DETB_SELECT01: J402.B9 ; also sheet 3
DETB_SELECT02: J402.A10 ; also sheet 3
DETB_SELECT03: J402.B7 ; also sheet 3
DETB_SELECT04: J402.B5 ; also sheet 3
DETB_SELECT05: J402.A6 ; also sheet 3
DETB_SELECT06: J403.B11 ; also sheet 3
DETB_SELECT07: J403.B9 ; also sheet 3
DETB_SELECT08: J403.A10 ; also sheet 3
DETB_SELECT09: J403.B7 ; also sheet 3
DETB_SELECT10: J403.B5 ; also sheet 3
DETB_SELECT11: J403.A6 ; also sheet 3
DETB_SELECT12: J404.B11 ; also sheet 3
DETB_SELECT13: J404.B9 ; also sheet 3
DETB_SELECT14: J404.A10 ; also sheet 3
DETB_SELECT15: J404.B7 ; also sheet 3
DETB_SELECT16: J404.B5 ; also sheet 3
DETB_SELECT17: J404.A6 ; also sheet 3
DETB_SELECT18: J405.B11 ; also sheet 3
DETB_SELECT19: J405.B9 ; also sheet 3
DETB_SELECT20: J405.A10 ; also sheet 3
DETB_SELECT21: J405.B7 ; also sheet 3
DETB_SELECT22: J405.B5 ; also sheet 3
DETB_SELECT23: J405.A6 ; also sheet 3
DETB_STATUS_SELECT0: J402.B16 ; also sheet 3
DETB_STATUS_SELECT1: J403.B16 ; also sheet 3
DETB_STATUS_SELECT2: J404.B16 ; also sheet 3
DETB_STATUS_SELECT3: J405.B16 ; also sheet 3
DETB_TRIGGER0: J402.B14 ; also sheet 3
DETB_TRIGGER1: J403.B14 ; also sheet 3
DETB_TRIGGER2: J404.B14 ; also sheet 3
DETB_TRIGGER3: J405.B14 ; also sheet 3
GND: J401.A1 J401.A9 J401.A12 J401.A13 J401.A14 J401.A15 J401.A16 J401.A17 J401.A19 J401.B1 J401.B2 J401.B3 J401.B17 J402.A1 J402.A4 J402.A8 J402.A12 J402.A13 J402.A14 J402.A15 J402.A17 J402.A19 J402.B3 J402.B4 J402.B8 J402.B12 J402.B17 J403.A1 J403.A4 J403.A8 J403.A12 J403.A13 J403.A14 J403.A15 J403.A17 J403.A19 J403.B3 J403.B4 J403.B8 J403.B12 J403.B17 J404.A1 J404.A4 J404.A8 J404.A12 J404.A13 J404.A14 J404.A15 J404.A17 J404.A19 J404.B3 J404.B4 J404.B8 J404.B12 J404.B17 J405.A1 J405.A4 J405.A8 J405.A12 J405.A13 J405.A14 J405.A15 J405.A17 J405.A19 J405.B3 J405.B4 J405.B8 J405.B12 J405.B17 ; also sheet 1,2,3,5,6,7,8,9
SRC_COL00: J401.A11 ; also sheet 3
SRC_COL01: J401.A10 ; also sheet 3
SRC_COL02: J401.A8 ; also sheet 3
SRC_COL03: J401.A7 ; also sheet 3
SRC_COL04: J401.A6 ; also sheet 3
SRC_COL05: J401.A5 ; also sheet 3
SRC_COL06: J401.B8 ; also sheet 3
SRC_COL07: J401.B7 ; also sheet 3
SRC_COL08: J401.A4 ; also sheet 3
SRC_COL09: J401.A3 ; also sheet 3
SRC_COL10: J401.B10 ; also sheet 3
SRC_COL11: J401.B9 ; also sheet 3
SRC_COL12: J401.B12 ; also sheet 3
SRC_COL13: J401.B11 ; also sheet 3
SRC_PWR0: J401.B6 ; also sheet 3
SRC_PWR1: J401.B5 ; also sheet 3
SRC_PWR2: J401.B4 ; also sheet 3
SRC_ROW0: J401.B16 ; also sheet 3
SRC_ROW1: J401.B15 ; also sheet 3
SRC_ROW2: J401.B14 ; also sheet 3
SRC_SPARE: J401.B13 ; also sheet 3
UART_DETB_TO_FPGA00: J402.B10 ; also sheet 3
UART_DETB_TO_FPGA01: J402.A11 ; also sheet 3
UART_DETB_TO_FPGA02: J402.A9 ; also sheet 3
UART_DETB_TO_FPGA03: J402.B6 ; also sheet 3
UART_DETB_TO_FPGA04: J402.A7 ; also sheet 3
UART_DETB_TO_FPGA05: J402.A5 ; also sheet 3
UART_DETB_TO_FPGA06: J403.B10 ; also sheet 3
UART_DETB_TO_FPGA07: J403.A11 ; also sheet 3
UART_DETB_TO_FPGA08: J403.A9 ; also sheet 3
UART_DETB_TO_FPGA09: J403.B6 ; also sheet 3
UART_DETB_TO_FPGA10: J403.A7 ; also sheet 3
UART_DETB_TO_FPGA11: J403.A5 ; also sheet 3
UART_DETB_TO_FPGA12: J404.B10 ; also sheet 3
UART_DETB_TO_FPGA13: J404.A11 ; also sheet 3
UART_DETB_TO_FPGA14: J404.A9 ; also sheet 3
UART_DETB_TO_FPGA15: J404.B6 ; also sheet 3
UART_DETB_TO_FPGA16: J404.A7 ; also sheet 3
UART_DETB_TO_FPGA17: J404.A5 ; also sheet 3
UART_DETB_TO_FPGA18: J405.B10 ; also sheet 3
UART_DETB_TO_FPGA19: J405.A11 ; also sheet 3
UART_DETB_TO_FPGA20: J405.A9 ; also sheet 3
UART_DETB_TO_FPGA21: J405.B6 ; also sheet 3
UART_DETB_TO_FPGA22: J405.A7 ; also sheet 3
UART_DETB_TO_FPGA23: J405.A5 ; also sheet 3
UART_FPGA_TO_DETB0: J402.B13 ; also sheet 3
UART_FPGA_TO_DETB1: J403.B13 ; also sheet 3
UART_FPGA_TO_DETB2: J404.B13 ; also sheet 3
UART_FPGA_TO_DETB3: J405.B13 ; also sheet 3
V5P1_B01: J402.A18 J402.A20 J402.B18 J402.B19 J402.B20 J403.A18 J403.A20 J403.B18 J403.B19 J403.B20 ; also sheet 7
V5P1_B23: J404.A18 J404.A20 J404.B18 J404.B19 J404.B20 J405.A18 J405.A20 J405.B18 J405.B19 J405.B20 ; also sheet 5,7
V5P1_SRC: J401.A18 J401.A20 J401.B18 J401.B19 J401.B20 ; also sheet 7
V9P0: J402.A3 J403.A3 J404.A3 J405.A3 ; also sheet 9
VN3P4: J401.A2 J402.A2 J403.A2 J404.A2 J405.A2 ; also sheet 5,8
VN22: J402.B1 J402.B2 J403.B1 J403.B2 J404.B1 J404.B2 J405.B1 J405.B2 ; also sheet 8

### Notes on the sheet
- Backplane Connectors
- Source Backplane
- Detector Backplane B0 | Detector Backplane B1
- Detector Backplane B2 | Detector Backplane B3

## Sheet 5 of 9: Aux IO
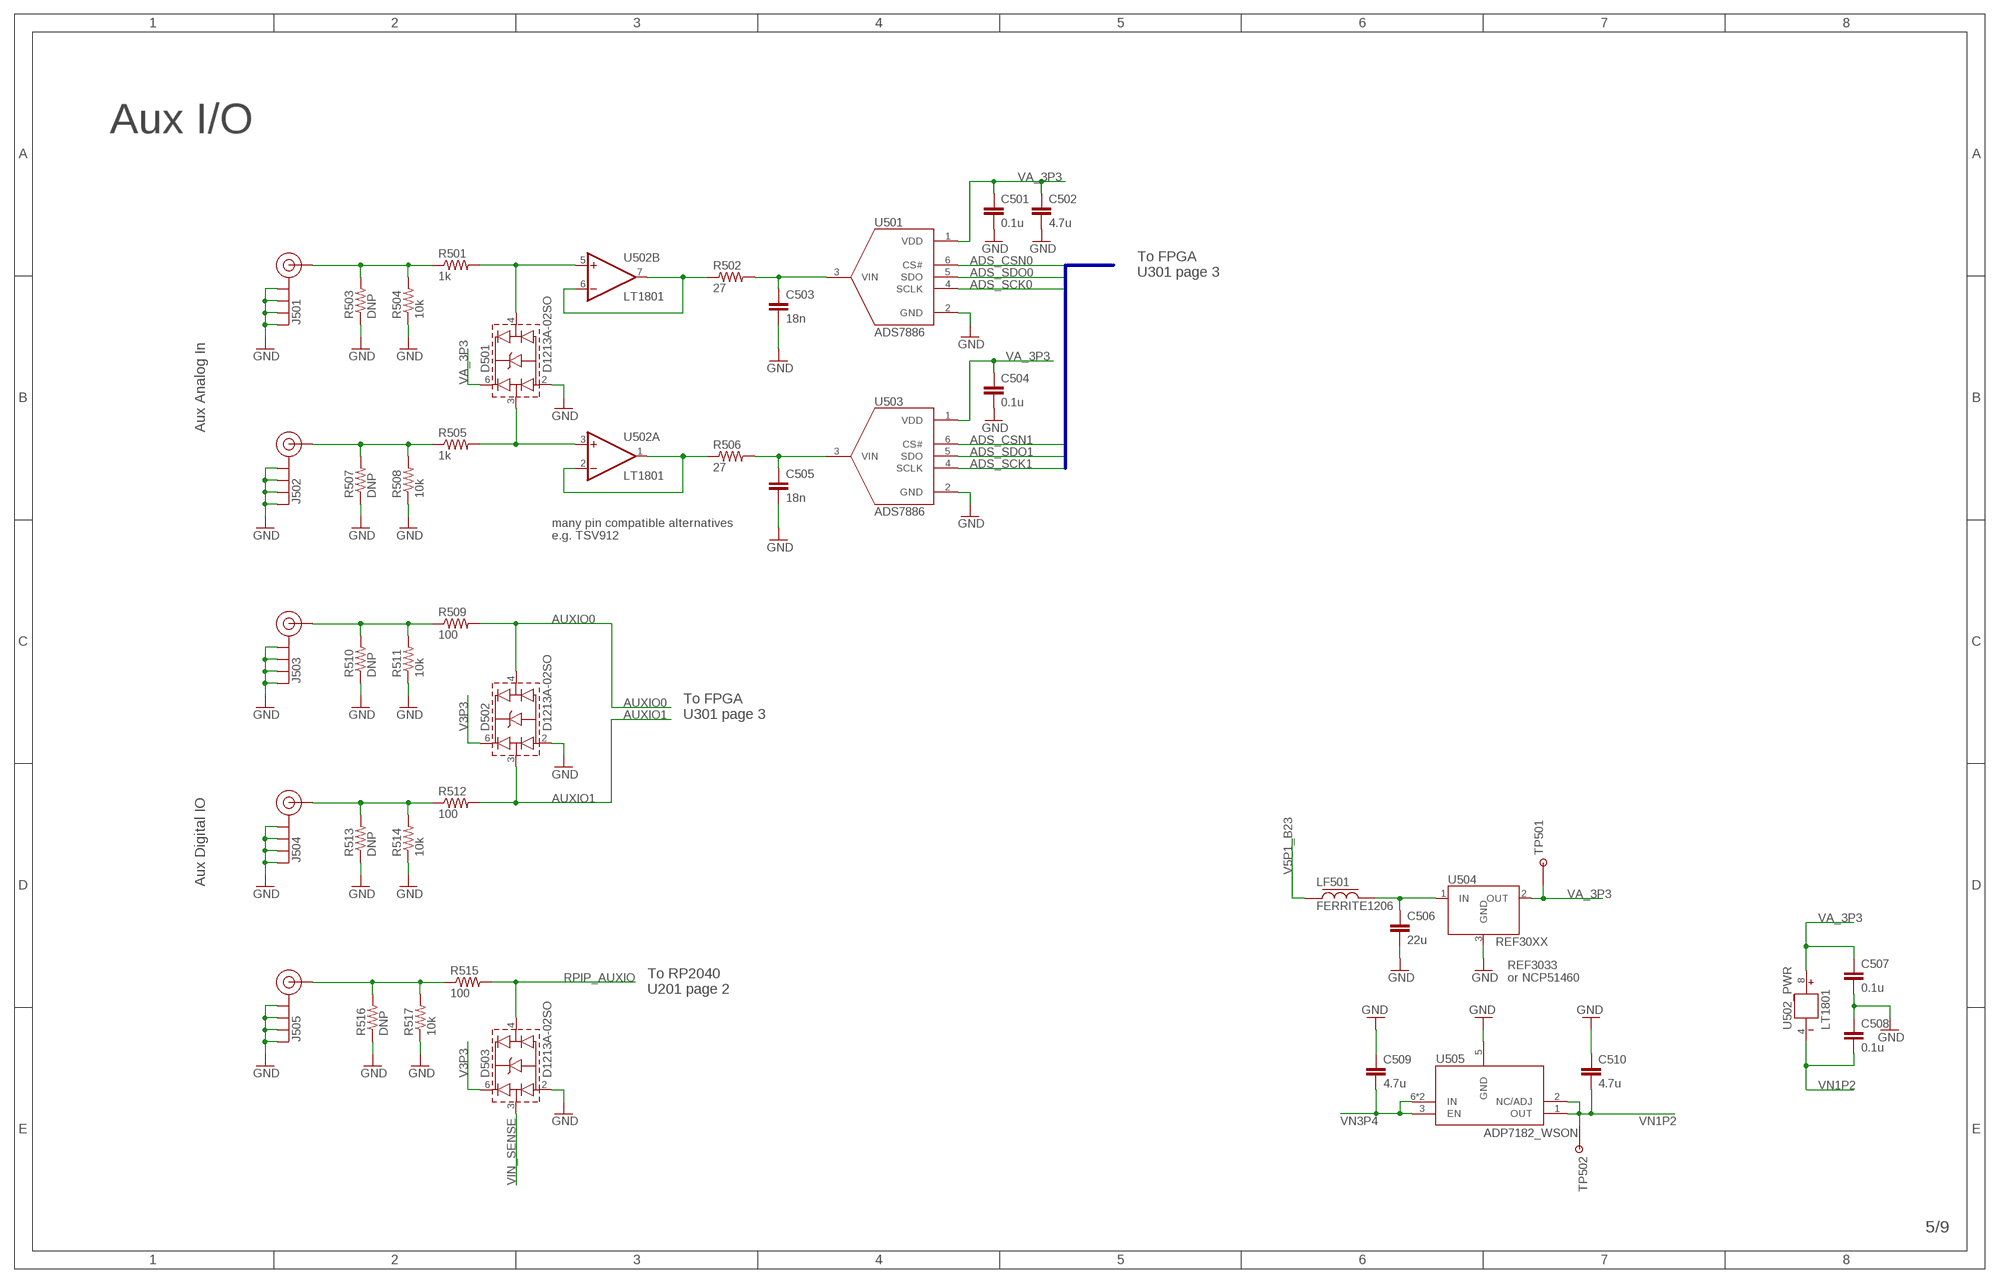
[diagram p4: schematic, sheet 5]

### Parts
C501  0.1u  CAP0402-CAP  [0402-CAP]
C502  4.7u  CAP0402-CAP  [0402-CAP]
C503  18n  CAP0603-CAP  [0603-CAP]
C504  0.1u  CAP0402-CAP  [0402-CAP]
C505  18n  CAP0603-CAP  [0603-CAP]
C506  22u  CAP0805-CAP  [0805-CAP]
C507  0.1u  CAP0402-CAP  [0402-CAP]
C508  0.1u  CAP0402-CAP  [0402-CAP]
C509  4.7u  CAP0402-CAP  [0402-CAP]
C510  4.7u  CAP0402-CAP  [0402-CAP]
D501  D1213A-02SO  [SOT23-6]
D502  D1213A-02SO  [SOT23-6]
D503  D1213A-02SO  [SOT23-6]
J501  SMAMMCX_PTH  [MMCX_PTH_STR]
J502  SMAMMCX_PTH  [MMCX_PTH_STR]
J503  SMAMMCX_PTH  [MMCX_PTH_STR]
J504  SMAMMCX_PTH  [MMCX_PTH_STR]
J505  SMAMMCX_PTH  [MMCX_PTH_STR]
LF501  FERRITE1206  [1206]
R501  1k  RESISTOR0402-RES  [0402-RES]
R502  27  RESISTOR0402-RES  [0402-RES]
R503  DNP  RESISTOR0805-RES  [0805]
R504  10k  RESISTOR0402-RES  [0402-RES]
R505  1k  RESISTOR0402-RES  [0402-RES]
R506  27  RESISTOR0402-RES  [0402-RES]
R507  DNP  RESISTOR0805-RES  [0805]
R508  10k  RESISTOR0402-RES  [0402-RES]
R509  100  RESISTOR0402-RES  [0402-RES]
R510  DNP  RESISTOR0805-RES  [0805]
R511  10k  RESISTOR0402-RES  [0402-RES]
R512  100  RESISTOR0402-RES  [0402-RES]
R513  DNP  RESISTOR0805-RES  [0805]
R514  10k  RESISTOR0402-RES  [0402-RES]
R515  100  RESISTOR0402-RES  [0402-RES]
R516  DNP  RESISTOR0805-RES  [0805]
R517  10k  RESISTOR0402-RES  [0402-RES]
TP501  TESTPOINT_ROUND  [TESTPAD_ROUND]
TP502  TESTPOINT_ROUND  [TESTPAD_ROUND]
U501  ADS7886  [SOT363]
U502  LT1801  LTC2051HV  [SOP65P490X110-8N]
U503  ADS7886  [SOT363]
U504  REF30XX  [SOT23-3]
U505  ADP7182_WSON  [WSON6]

### Nets
ADS_CSN0: U501.6(CS#) ; also sheet 3
ADS_CSN1: U503.6(CS#) ; also sheet 3
ADS_SCK0: U501.4(SCLK) ; also sheet 3
ADS_SCK1: U503.4(SCLK) ; also sheet 3
ADS_SDO0: U501.5(SDO) ; also sheet 3
ADS_SDO1: U503.5(SDO) ; also sheet 3
AUXIO0: D502.4(CH2) R509.2 ; also sheet 3
AUXIO1: D502.3(CH1) R512.2 ; also sheet 3
GND: C501.2 C502.2 C503.2 C504.2 C505.2 C506.2 C507.2 C508.1 C509.1 C510.1 D501.2(VN) D502.2(VN) D503.2(VN) J501.G@1(GND) J501.G@2(GND) J501.G@3(GND) J501.G@4(GND) J502.G@1(GND) J502.G@2(GND) J502.G@3(GND) J502.G@4(GND) J503.G@1(GND) J503.G@2(GND) J503.G@3(GND) J503.G@4(GND) J504.G@1(GND) J504.G@2(GND) J504.G@3(GND) J504.G@4(GND) J505.G@1(GND) J505.G@2(GND) J505.G@3(GND) J505.G@4(GND) R503.1 R504.1 R507.1 R508.1 R510.1 R511.1 R513.1 R514.1 R516.1 R517.1 U501.2(GND) U503.2(GND) U504.3(GND) U505.5(GND) ; also sheet 1,2,3,4,6,7,8,9
N$46: J501.C(SIGNAL) R501.1 R503.2 R504.2
N$47: D501.4(CH2) R501.2 U502.5(B:+IN)
N$48: J502.C(SIGNAL) R505.1 R507.2 R508.2
N$49: D501.3(CH1) R505.2 U502.3(A:+IN)
N$53: J505.C(SIGNAL) R515.1 R516.2 R517.2
N$60: J503.C(SIGNAL) R509.1 R510.2 R511.2
N$62: J504.C(SIGNAL) R512.1 R513.2 R514.2
N$75: C503.1 R502.2 U501.3(VIN)
N$76: R502.1 U502.6(B:-IN) U502.7(B:OUT)
N$79: C505.1 R506.2 U503.3(VIN)
N$80: R506.1 U502.1(A:OUT) U502.2(A:-IN)
N$97: C506.1 LF501.2 U504.1(IN)
RPIP_AUXIO: D503.4(CH2) R515.2 ; also sheet 2
V3P3: D502.6(VP) D503.6(VP) ; also sheet 2,3,6,7,9
V5P1_B23: LF501.1 ; also sheet 4,7
VA_3P3: C501.1 C502.1 C504.1 C507.1 D501.6(VP) TP501.P$1 U501.1(VDD) U502.8(_PWR:V+) U503.1(VDD) U504.2(OUT)
VIN_SENSE: D503.3(CH1) ; also sheet 2
VN1P2: C508.2 C510.2 TP502.P$1 U502.4(_PWR:V-) U505.1(OUT) U505.2(NC/ADJ)
VN3P4: C509.2 U505.3(EN) U505.6(IN) U505.PAD(IN) ; also sheet 4,8

### Buses
ADS_CS#[0..1],ADS_SDO#[0..1],ADS_SCLK#[0..1]

### Notes on the sheet
- Aux I/O
- To FPGA
  U301 page 3
- Aux Analog In
- many pin compatible alternatives
  e.g. TSV912
- To FPGA
  U301 page 3
- Aux Digital IO
- REF3033
  or NCP51460
- To RP2040
  U201 page 2

## Sheet 6 of 9: Misc
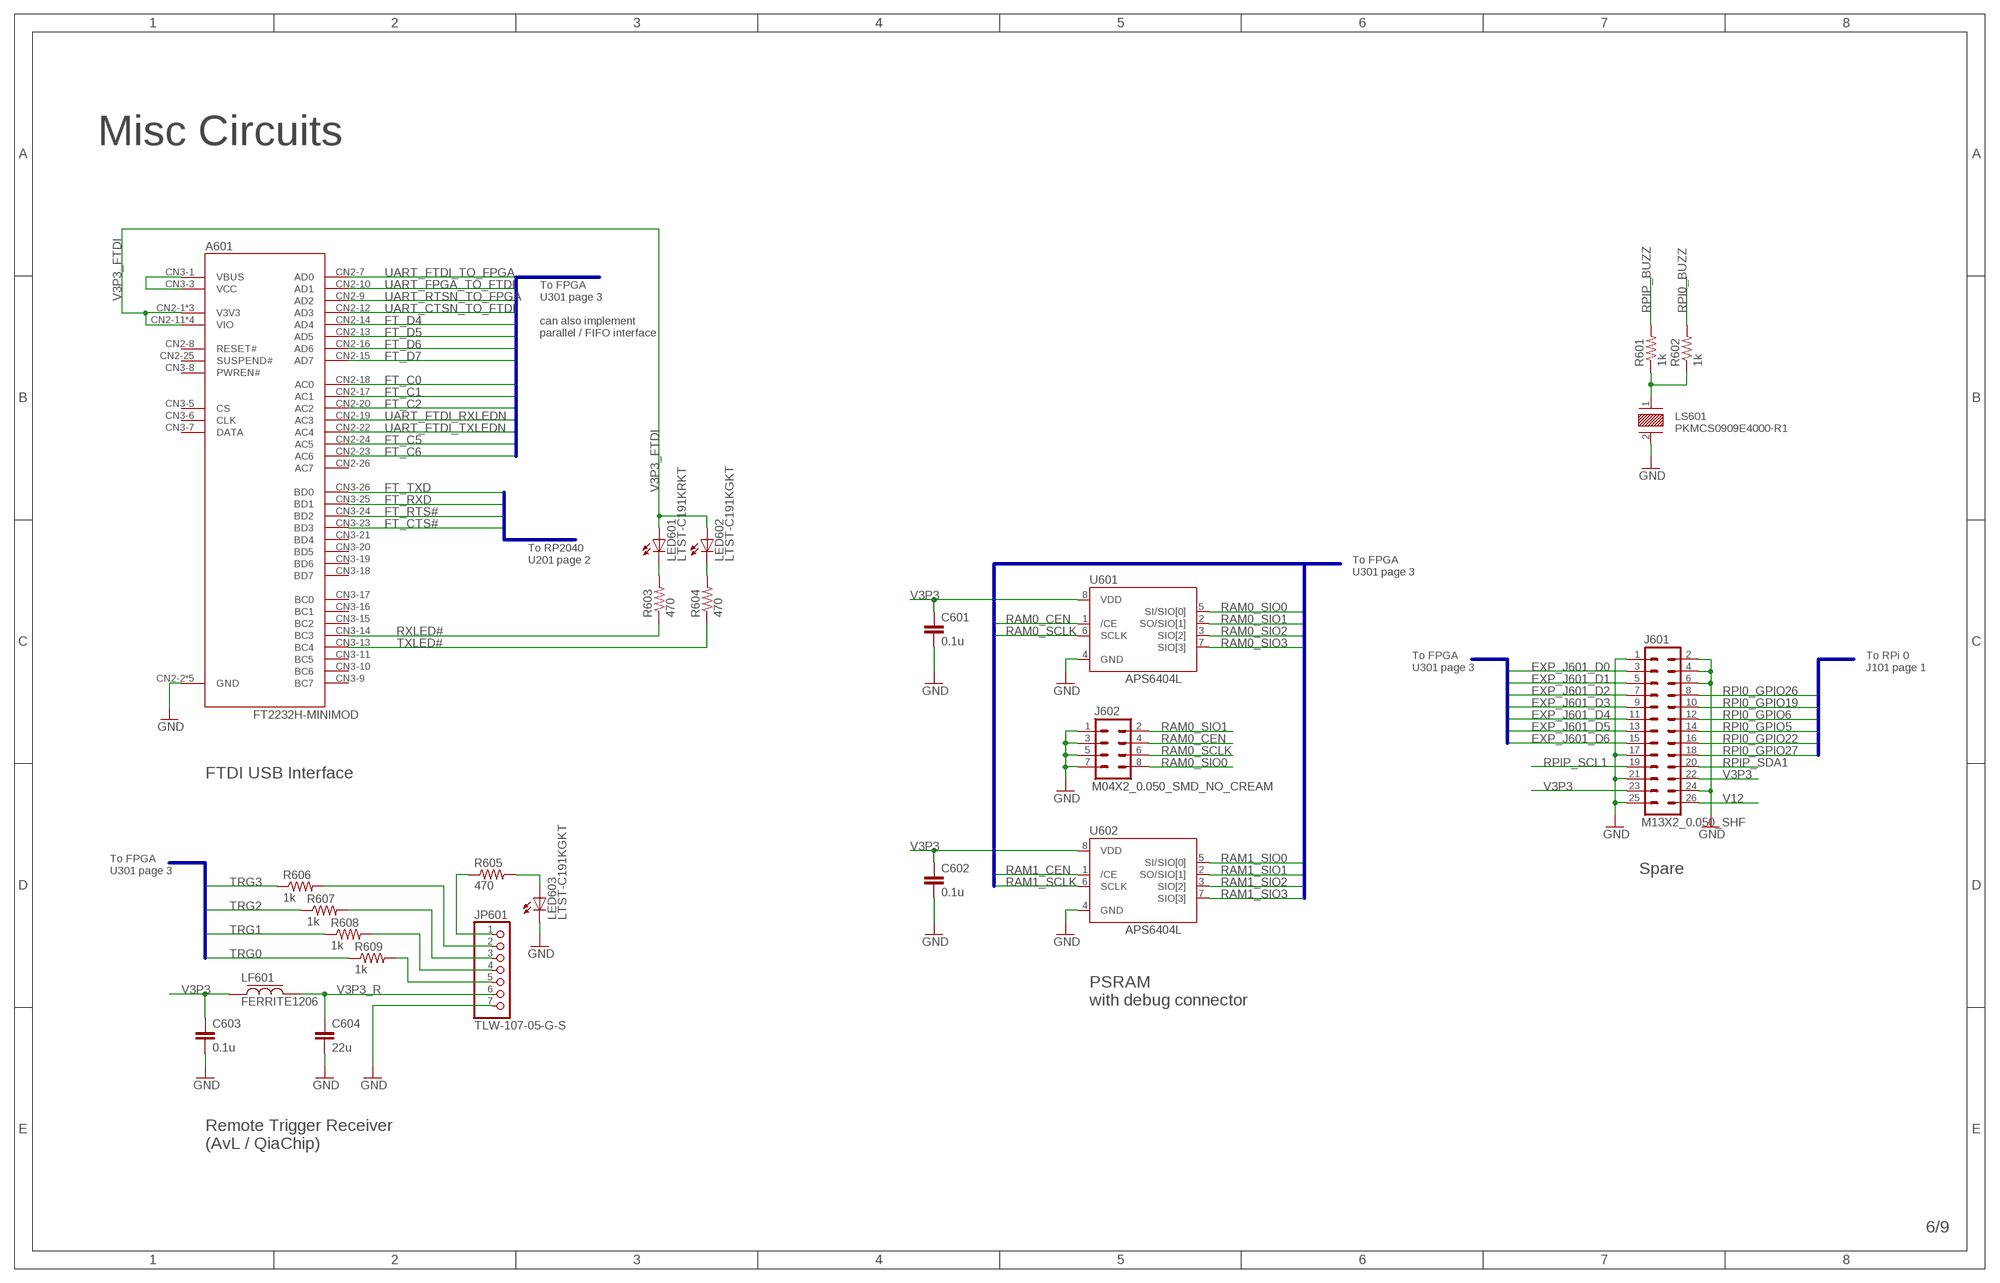
[diagram p5: schematic, sheet 6]

### Parts
A601  FT2232H-MINIMOD  [FT2232H-MINIMOD]
C601  0.1u  CAP0402-CAP  [0402-CAP]
C602  0.1u  CAP0402-CAP  [0402-CAP]
C603  0.1u  CAP0402-CAP  [0402-CAP]
C604  22u  CAP0805-CAP  [0805-CAP]
J601  M13X2_0.050_SHF  [M13X2_0.050_SHF]
J602  M04X2_0.050_SMD_NO_CREAM  [M04X2_0.050_SMD_NO_CREAM]
JP601  TLW-107-05-G-S  PINHD-1X7  [1X07]
LED601  LTST-C191KRKT  LED0603  [LED-0603]
LED602  LTST-C191KGKT  LED0603  [LED-0603]
LED603  LTST-C191KGKT  LED0603  [LED-0603]
LF601  FERRITE1206  [1206]
LS601  PKMCS0909E4000-R1  [XDCR_PKMCS0909E4000-R1]
R601  1k  RESISTOR0402-RES  [0402-RES]
R602  1k  RESISTOR0402-RES  [0402-RES]
R603  470  RESISTOR0402-RES  [0402-RES]
R604  470  RESISTOR0402-RES  [0402-RES]
R605  470  RESISTOR0402-RES  [0402-RES]
R606  1k  RESISTOR0402-RES  [0402-RES]
R607  1k  RESISTOR0402-RES  [0402-RES]
R608  1k  RESISTOR0402-RES  [0402-RES]
R609  1k  RESISTOR0402-RES  [0402-RES]
U601  APS6404L  [USON8L-2X3MM]
U602  APS6404L  [USON8L-2X3MM]

### Nets
EXP_J601_D0: J601.3 ; also sheet 3
EXP_J601_D1: J601.5 ; also sheet 3
EXP_J601_D2: J601.7 ; also sheet 3
EXP_J601_D3: J601.9 ; also sheet 3
EXP_J601_D4: J601.11 ; also sheet 3
EXP_J601_D5: J601.13 ; also sheet 3
EXP_J601_D6: J601.15 ; also sheet 3
FT_C0: A601.CN2-18(AC0) ; also sheet 3
FT_C1: A601.CN2-17(AC1) ; also sheet 3
FT_C2: A601.CN2-20(AC2) ; also sheet 3
FT_C5: A601.CN2-24(AC5) ; also sheet 3
FT_C6: A601.CN2-23(AC6) ; also sheet 3
FT_CTS#: A601.CN3-23(BD3) ; also sheet 2
FT_D4: A601.CN2-14(AD4) ; also sheet 3
FT_D5: A601.CN2-13(AD5) ; also sheet 3
FT_D6: A601.CN2-16(AD6) ; also sheet 3
FT_D7: A601.CN2-15(AD7) ; also sheet 3
FT_RTS#: A601.CN3-24(BD2) ; also sheet 2
FT_RXD: A601.CN3-25(BD1) ; also sheet 2
FT_TXD: A601.CN3-26(BD0) ; also sheet 2
GND: A601.CN2-2(GND) A601.CN2-4(GND) A601.CN2-6(GND) A601.CN3-2(GND) A601.CN3-4(GND) C601.2 C602.2 C603.2 C604.2 J601.1 J601.2 J601.4 J601.6 J601.17 J601.21 J601.24 J601.25 J602.1 J602.3 J602.5 J602.7 JP601.7 LED603.C LS601.2 U601.4(GND) U602.4(GND) ; also sheet 1,2,3,4,5,7,8,9
LED: JP601.1 R605.1
N$8: A601.CN3-1(VBUS) A601.CN3-3(VCC)
N$51: LED601.C R603.2
N$52: LED602.C R604.2
N$59: LS601.1 R601.1 R602.1
N$211: JP601.5 R609.2
N$212: JP601.4 R608.2
N$213: JP601.3 R607.2
N$214: JP601.2 R606.2
N$215: LED603.A R605.2
RAM0_CEN: J602.4 U601.1(/CE) ; also sheet 3
RAM0_SCLK: J602.6 U601.6(SCLK) ; also sheet 3
RAM0_SIO0: J602.8 U601.5(SI/SIO[0]) ; also sheet 3
RAM0_SIO1: J602.2 U601.2(SO/SIO[1]) ; also sheet 3
RAM0_SIO2: U601.3(SIO[2]) ; also sheet 3
RAM0_SIO3: U601.7(SIO[3]) ; also sheet 3
RAM1_CEN: U602.1(/CE) ; also sheet 3
RAM1_SCLK: U602.6(SCLK) ; also sheet 3
RAM1_SIO0: U602.5(SI/SIO[0]) ; also sheet 3
RAM1_SIO1: U602.2(SO/SIO[1]) ; also sheet 3
RAM1_SIO2: U602.3(SIO[2]) ; also sheet 3
RAM1_SIO3: U602.7(SIO[3]) ; also sheet 3
RPI0_BUZZ: R602.2 ; also sheet 1
RPI0_GPIO5: J601.14 ; also sheet 1
RPI0_GPIO6: J601.12 ; also sheet 1
RPI0_GPIO19: J601.10 ; also sheet 1
RPI0_GPIO22: J601.16 ; also sheet 1
RPI0_GPIO26: J601.8 ; also sheet 1
RPI0_GPIO27: J601.18 ; also sheet 1
RPIP_BUZZ: R601.2 ; also sheet 2
RPIP_SCL1: J601.19 ; also sheet 2
RPIP_SDA1: J601.20 ; also sheet 2
RXLED#: A601.CN3-14(BC3) R603.1
TRG0: R609.1 ; also sheet 3
TRG1: R608.1 ; also sheet 3
TRG2: R607.1 ; also sheet 3
TRG3: R606.1 ; also sheet 3
TXLED#: A601.CN3-13(BC4) R604.1
UART_CTSN_TO_FTDI: A601.CN2-12(AD3) ; also sheet 3
UART_FPGA_TO_FTDI: A601.CN2-10(AD1) ; also sheet 3
UART_FTDI_RXLEDN: A601.CN2-19(AC3) ; also sheet 3
UART_FTDI_TO_FPGA: A601.CN2-7(AD0) ; also sheet 3
UART_FTDI_TXLEDN: A601.CN2-22(AC4) ; also sheet 3
UART_RTSN_TO_FPGA: A601.CN2-9(AD2) ; also sheet 3
V3P3: C601.1 C602.1 C603.1 J601.22 J601.23 LF601.1 U601.8(VDD) U602.8(VDD) ; also sheet 2,3,5,7,9
V3P3_FTDI: A601.CN2-1(V3V3) A601.CN2-3(V3V3) A601.CN2-5(V3V3) A601.CN2-11(VIO) A601.CN2-21(VIO) A601.CN3-12(VIO) A601.CN3-22(VIO) LED601.A LED602.A
V3P3_R: C604.1 JP601.6 LF601.2
V12: J601.26 ; also sheet 2,7,8,9
Unconnected: A601.CN2-8(RESET#) A601.CN2-25(SUSPEND#) A601.CN2-26(AC7) A601.CN3-5(CS) A601.CN3-6(CLK) A601.CN3-7(DATA) A601.CN3-8(PWREN#) A601.CN3-9(BC7) A601.CN3-10(BC6) A601.CN3-11(BC5) A601.CN3-15(BC2) A601.CN3-16(BC1) A601.CN3-17(BC0) A601.CN3-18(BD7) A601.CN3-19(BD6) A601.CN3-20(BD5) A601.CN3-21(BD4)

### Buses
FT_TXD,FT_RTS#,FT_CTS#,FT_RXD
FT_D[0..7],FT_DXF#,FT_TXE#,FT_RD#,FT_WR#,FT_SIWUA,FT_CLKOUT,FT_OE#
JTAGENB,PROGRAMN,INITN,FP_E10,FP_D11,FP_C12,DONE
RPI0_GPIO5,RPI0_GPIO6,RPI0_GPIO19,RPI0_GPIO22,RPI0_GPIO26,RPI0_GPIO27
TRG[0..3]
RAM0_SIO[0..3],RAM0_/CE,RAM0_SCLK,RAM1_SIO[0..3],RAM1_/CE,RAM1_SCLK

### Notes on the sheet
- Misc Circuits
- To FPGA
  U301 page 3
- can also implement
  parallel / FIFO interface
- To RP2040
  U201 page 2
- To FPGA
  U301 page 3
- To FPGA
  U301 page 3
- To RPi 0
  J101 page 1
- FTDI USB Interface
- To FPGA
  U301 page 3
- Spare
- PSRAM
  with debug connector
- Remote Trigger Receiver
  (AvL / QiaChip)

## Sheet 7 of 9: VReg
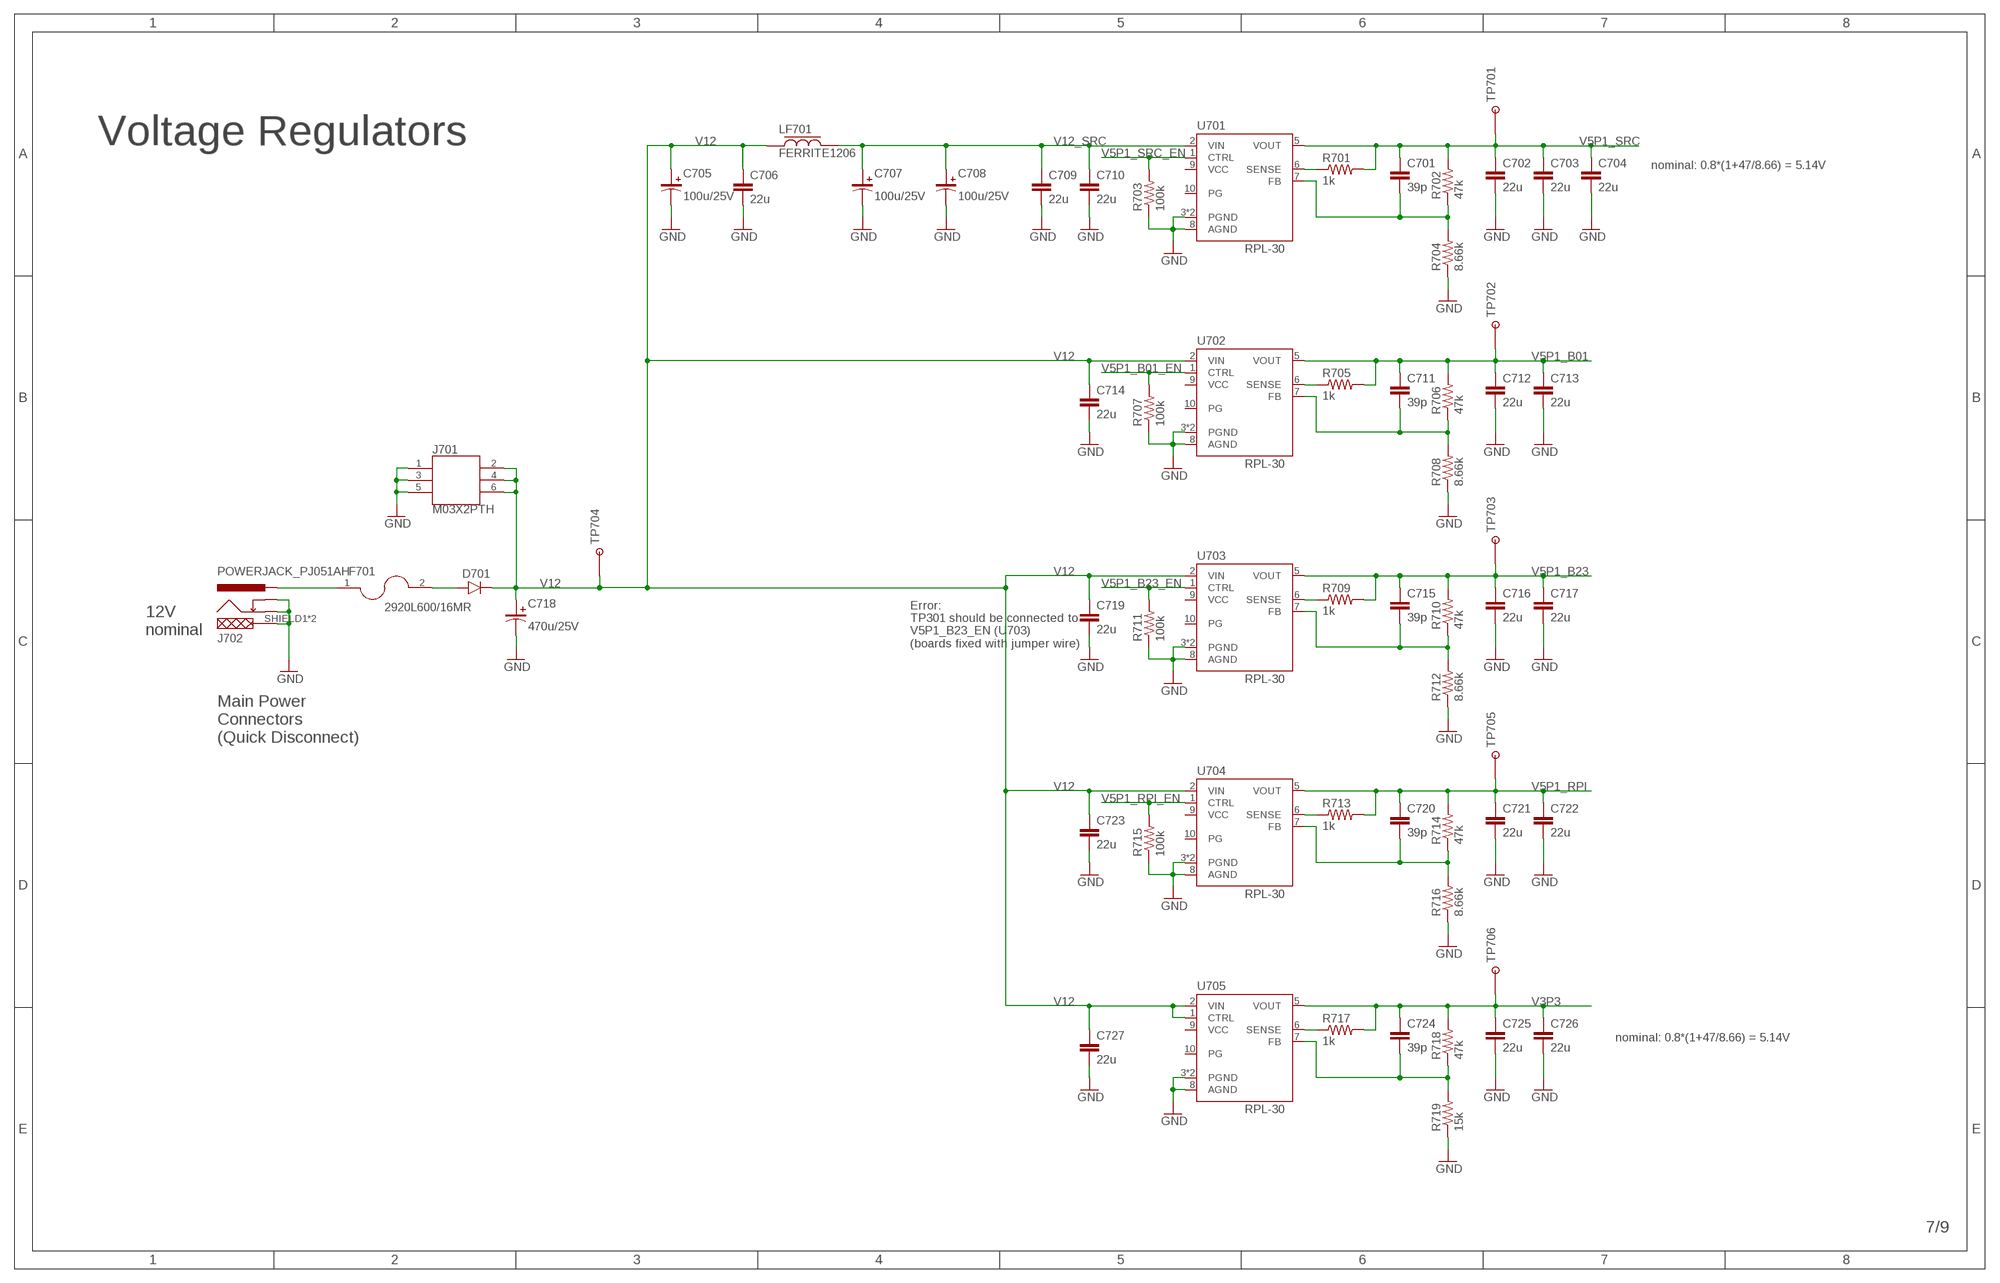
[diagram p6: schematic, sheet 7]

### Parts
C701  39p  CAP0402-CAP  [0402-CAP]
C702  22u  CAP0805-CAP  [0805-CAP]
C703  22u  CAP0805-CAP  [0805-CAP]
C704  22u  CAP0805-CAP  [0805-CAP]
C705  100u/25V  CAP-POL2917  [2917-CAP]
C706  22u  CAP0805-CAP  [0805-CAP]
C707  100u/25V  CAP-POL2917  [2917-CAP]
C708  100u/25V  CAP-POL2917  [2917-CAP]
C709  22u  CAP0805-CAP  [0805-CAP]
C710  22u  CAP0805-CAP  [0805-CAP]
C711  39p  CAP0402-CAP  [0402-CAP]
C712  22u  CAP0805-CAP  [0805-CAP]
C713  22u  CAP0805-CAP  [0805-CAP]
C714  22u  CAP0805-CAP  [0805-CAP]
C715  39p  CAP0402-CAP  [0402-CAP]
C716  22u  CAP0805-CAP  [0805-CAP]
C717  22u  CAP0805-CAP  [0805-CAP]
C718  470u/25V  CAP-POL12.5MM  [CAP-SMD-POL-12.5]
C719  22u  CAP0805-CAP  [0805-CAP]
C720  39p  CAP0402-CAP  [0402-CAP]
C721  22u  CAP0805-CAP  [0805-CAP]
C722  22u  CAP0805-CAP  [0805-CAP]
C723  22u  CAP0805-CAP  [0805-CAP]
C724  39p  CAP0402-CAP  [0402-CAP]
C725  22u  CAP0805-CAP  [0805-CAP]
C726  22u  CAP0805-CAP  [0805-CAP]
C727  22u  CAP0805-CAP  [0805-CAP]
D701  DIODESOD128  [SOD128]
F701  2920L600/16MR  FUSE_2920  [2920-FUSE]
J701  M03X2PTH  [2X3-NS]
J702  POWERJACK_PJ051AH  [PJ051AH]
LF701  FERRITE1206  [1206]
R701  1k  RESISTOR0402-RES  [0402-RES]
R702  47k  RESISTOR0402-RES  [0402-RES]
R703  100k  RESISTOR0402-RES  [0402-RES]
R704  8.66k  RESISTOR0402-RES  [0402-RES]
R705  1k  RESISTOR0402-RES  [0402-RES]
R706  47k  RESISTOR0402-RES  [0402-RES]
R707  100k  RESISTOR0402-RES  [0402-RES]
R708  8.66k  RESISTOR0402-RES  [0402-RES]
R709  1k  RESISTOR0402-RES  [0402-RES]
R710  47k  RESISTOR0402-RES  [0402-RES]
R711  100k  RESISTOR0402-RES  [0402-RES]
R712  8.66k  RESISTOR0402-RES  [0402-RES]
R713  1k  RESISTOR0402-RES  [0402-RES]
R714  47k  RESISTOR0402-RES  [0402-RES]
R715  100k  RESISTOR0402-RES  [0402-RES]
R716  8.66k  RESISTOR0402-RES  [0402-RES]
R717  1k  RESISTOR0402-RES  [0402-RES]
R718  47k  RESISTOR0402-RES  [0402-RES]
R719  15k  RESISTOR0402-RES  [0402-RES]
TP701  TESTPOINT_ROUND  [TESTPAD_ROUND]
TP702  TESTPOINT_ROUND  [TESTPAD_ROUND]
TP703  TESTPOINT_ROUND  [TESTPAD_ROUND]
TP704  TESTPOINT_ROUND  [TESTPAD_ROUND]
TP705  TESTPOINT_ROUND  [TESTPAD_ROUND]
TP706  TESTPOINT_ROUND  [TESTPAD_ROUND]
U701  RPL-30  [RPL-30]
U702  RPL-30  [RPL-30]
U703  RPL-30  [RPL-30]
U704  RPL-30  [RPL-30]
U705  RPL-30  [RPL-30]

### Nets
GND: C702.2 C703.2 C704.2 C705.N C706.2 C707.N C708.N C709.2 C710.2 C712.2 C713.2 C714.2 C716.2 C717.2 C718.N C719.2 C721.2 C722.2 C723.2 C725.2 C726.2 C727.2 J701.1 J701.3 J701.5 J702.SHIELD1(SHIELD) J702.SHIELD2(SHIELD) J702.SLEEVE(GND) J702.SWITCH(GNDBREAK) R703.1 R704.1 R707.1 R708.1 R711.1 R712.1 R715.1 R716.1 R719.1 U701.3(PGND) U701.4(PGND) U701.8(AGND) U702.3(PGND) U702.4(PGND) U702.8(AGND) U703.3(PGND) U703.4(PGND) U703.8(AGND) U704.3(PGND) U704.4(PGND) U704.8(AGND) U705.3(PGND) U705.4(PGND) U705.8(AGND) ; also sheet 1,2,3,4,5,6,8,9
N$3: C701.2 R702.1 R704.2 U701.7(FB)
N$4: R701.1 U701.6(SENSE)
N$11: F701.1 J702.CENTER(PWR)
N$28: C711.2 R706.1 R708.2 U702.7(FB)
N$33: R705.1 U702.6(SENSE)
N$34: C715.2 R710.1 R712.2 U703.7(FB)
N$38: R709.1 U703.6(SENSE)
N$40: C720.2 R714.1 R716.2 U704.7(FB)
N$42: R713.1 U704.6(SENSE)
N$44: C724.2 R718.1 R719.2 U705.7(FB)
N$45: R717.1 U705.6(SENSE)
N$89: D701.A F701.2
V3P3: C724.1 C725.1 C726.1 R717.2 R718.2 TP706.P$1 U705.5(VOUT) ; also sheet 2,3,5,6,9
V5P1_B01: C711.1 C712.1 C713.1 R705.2 R706.2 TP702.P$1 U702.5(VOUT) ; also sheet 4
V5P1_B01_EN: R707.2 U702.1(CTRL) ; also sheet 3
V5P1_B23: C715.1 C716.1 C717.1 R709.2 R710.2 TP703.P$1 U703.5(VOUT) ; also sheet 4,5
V5P1_B23_EN: R711.2 U703.1(CTRL)
V5P1_RPI: C720.1 C721.1 C722.1 R713.2 R714.2 TP705.P$1 U704.5(VOUT) ; also sheet 1
V5P1_RPI_EN: R715.2 U704.1(CTRL) ; also sheet 3
V5P1_SRC: C701.1 C702.1 C703.1 C704.1 R701.2 R702.2 TP701.P$1 U701.5(VOUT) ; also sheet 4
V5P1_SRC_EN: R703.2 U701.1(CTRL) ; also sheet 3
V12: C705.P C706.1 C714.1 C718.P C719.1 C723.1 C727.1 D701.C J701.2 J701.4 J701.6 LF701.1 TP704.P$1 U702.2(VIN) U703.2(VIN) U704.2(VIN) U705.1(CTRL) U705.2(VIN) ; also sheet 2,6,8,9
V12_SRC: C707.P C708.P C709.1 C710.1 LF701.2 U701.2(VIN)
Unconnected: U701.9(VCC) U701.10(PG) U702.9(VCC) U702.10(PG) U703.9(VCC) U703.10(PG) U704.9(VCC) U704.10(PG) U705.9(VCC) U705.10(PG)

### Notes on the sheet
- Voltage Regulators
- nominal: 0.8*(1+47/8.66) = 5.14V
- 12V
  nominal
- Error:
  TP301 should be connected to
  V5P1_B23_EN (U703)
  (boards fixed with jumper wire)
- Main Power
  Connectors
  (Quick Disconnect)
- nominal: 0.8*(1+47/8.66) = 5.14V

## Sheet 8 of 9: Negative VReg
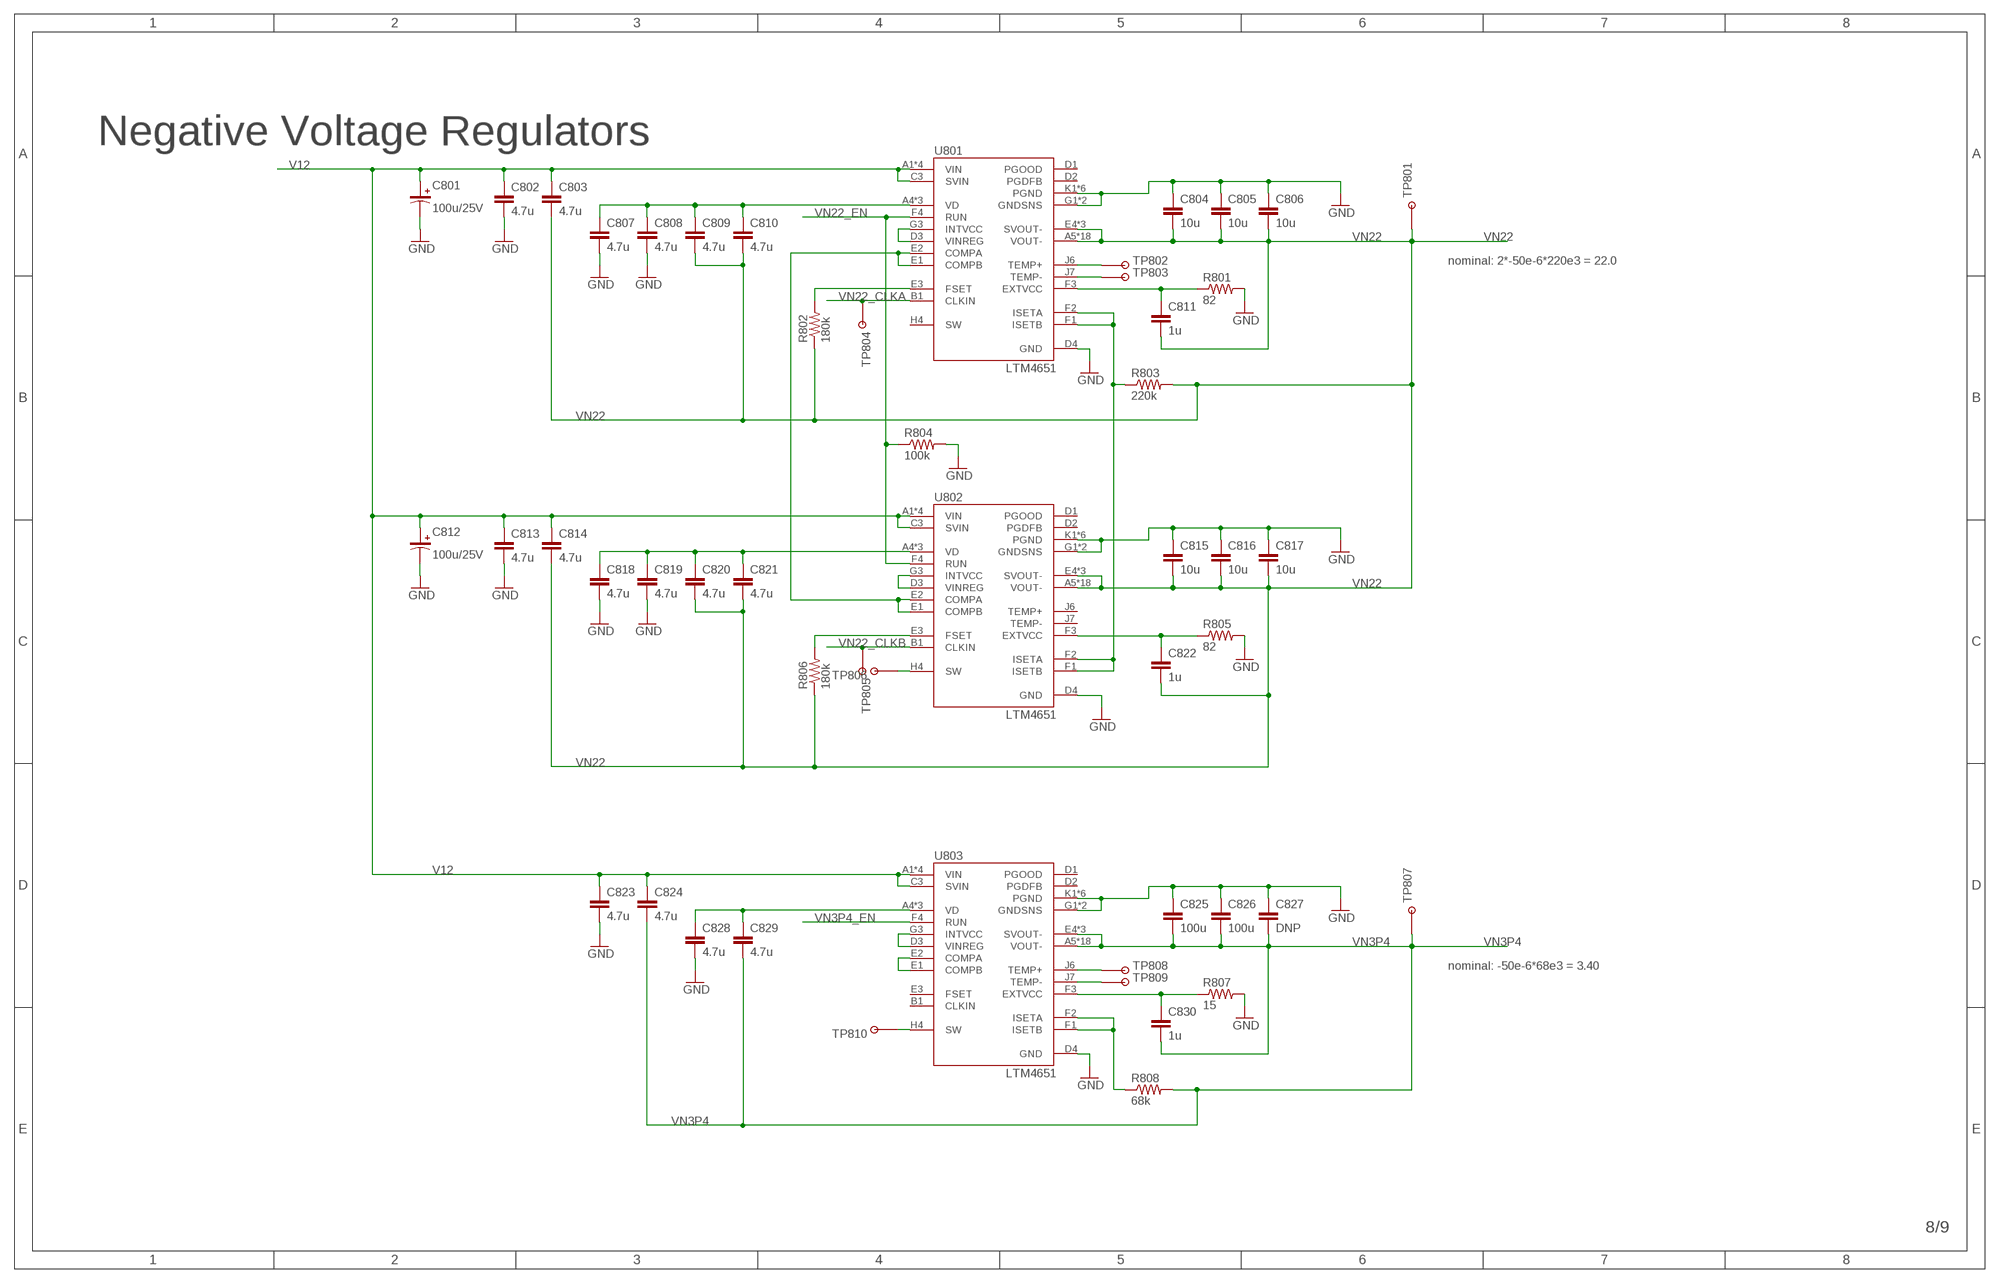
[diagram p7: schematic, sheet 8]

### Parts
C801  100u/25V  CAP-POL2917  [2917-CAP]
C802  4.7u  CAP0805-CAP  [0805-CAP]
C803  4.7u  CAP0805-CAP  [0805-CAP]
C804  10u  CAP1206  [1206]
C805  10u  CAP1206  [1206]
C806  10u  CAP1206  [1206]
C807  4.7u  CAP0805-CAP  [0805-CAP]
C808  4.7u  CAP0805-CAP  [0805-CAP]
C809  4.7u  CAP0805-CAP  [0805-CAP]
C810  4.7u  CAP0805-CAP  [0805-CAP]
C811  1u  CAP0603-CAP  [0603-CAP]
C812  100u/25V  CAP-POL2917  [2917-CAP]
C813  4.7u  CAP0805-CAP  [0805-CAP]
C814  4.7u  CAP0805-CAP  [0805-CAP]
C815  10u  CAP1206  [1206]
C816  10u  CAP1206  [1206]
C817  10u  CAP1206  [1206]
C818  4.7u  CAP0805-CAP  [0805-CAP]
C819  4.7u  CAP0805-CAP  [0805-CAP]
C820  4.7u  CAP0805-CAP  [0805-CAP]
C821  4.7u  CAP0805-CAP  [0805-CAP]
C822  1u  CAP0603-CAP  [0603-CAP]
C823  4.7u  CAP0805-CAP  [0805-CAP]
C824  4.7u  CAP0805-CAP  [0805-CAP]
C825  100u  CAP1206  [1206]
C826  100u  CAP1206  [1206]
C827  DNP  CAP1206  [1206]
C828  4.7u  CAP0805-CAP  [0805-CAP]
C829  4.7u  CAP0805-CAP  [0805-CAP]
C830  1u  CAP0603-CAP  [0603-CAP]
R801  82  RESISTOR0402-RES  [0402-RES]
R802  180k  RESISTOR0402-RES  [0402-RES]
R803  220k  RESISTOR0402-RES  [0402-RES]
R804  100k  RESISTOR0402-RES  [0402-RES]
R805  82  RESISTOR0402-RES  [0402-RES]
R806  180k  RESISTOR0402-RES  [0402-RES]
R807  15  RESISTOR0402-RES  [0402-RES]
R808  68k  RESISTOR0402-RES  [0402-RES]
TP801  TESTPOINT_ROUND  [TESTPAD_ROUND]
TP802  TESTPOINT_ROUND  [TESTPAD_ROUND]
TP803  TESTPOINT_ROUND  [TESTPAD_ROUND]
TP804  TESTPOINT_ROUND  [TESTPAD_ROUND]
TP805  TESTPOINT_ROUND  [TESTPAD_ROUND]
TP806  TESTPOINT_ROUND  [TESTPAD_ROUND]
TP807  TESTPOINT_ROUND  [TESTPAD_ROUND]
TP808  TESTPOINT_ROUND  [TESTPAD_ROUND]
TP809  TESTPOINT_ROUND  [TESTPAD_ROUND]
TP810  TESTPOINT_ROUND  [TESTPAD_ROUND]
U801  LTM4651  [BGA-77]
U802  LTM4651  [BGA-77]
U803  LTM4651  [BGA-77]

### Nets
GND: C801.N C802.2 C804.1 C805.1 C806.1 C807.2 C808.2 C812.N C813.2 C815.1 C816.1 C817.1 C818.2 C819.2 C823.2 C825.1 C826.1 C827.1 C828.2 R801.2 R804.2 R805.2 R807.2 U801.D4(GND) U801.G1(GNDSNS) U801.H1(GNDSNS) U801.K1(PGND) U801.K2(PGND) U801.K3(PGND) U801.L1(PGND) U801.L2(PGND) U801.L3(PGND) U802.D4(GND) U802.G1(GNDSNS) U802.H1(GNDSNS) U802.K1(PGND) U802.K2(PGND) U802.K3(PGND) U802.L1(PGND) U802.L2(PGND) U802.L3(PGND) U803.D4(GND) U803.G1(GNDSNS) U803.H1(GNDSNS) U803.K1(PGND) U803.K2(PGND) U803.K3(PGND) U803.L1(PGND) U803.L2(PGND) U803.L3(PGND) ; also sheet 1,2,3,4,5,6,7,9
N$1: U803.D3(VINREG) U803.G3(INTVCC)
N$2: TP802.P$1 U801.J6(TEMP+)
N$5: U803.E1(COMPB) U803.E2(COMPA)
N$6: U801.D3(VINREG) U801.G3(INTVCC)
N$7: U801.E1(COMPB) U801.E2(COMPA) U802.E1(COMPB) U802.E2(COMPA)
N$9: R802.2 U801.E3(FSET)
N$12: TP803.P$1 U801.J7(TEMP-)
N$13: C811.1 R801.1 U801.F3(EXTVCC)
N$19: C822.1 R805.1 U802.F3(EXTVCC)
N$20: TP808.P$1 U803.J6(TEMP+)
N$21: TP809.P$1 U803.J7(TEMP-)
N$22: R803.1 U801.F1(ISETB) U801.F2(ISETA) U802.F1(ISETB) U802.F2(ISETA)
N$23: U802.D3(VINREG) U802.G3(INTVCC)
N$25: TP806.P$1 U802.H4(SW)
N$26: C830.1 R807.1 U803.F3(EXTVCC)
N$27: C807.1 C808.1 C809.1 C810.1 U801.A4(VD) U801.B4(VD) U801.C4(VD)
N$31: C818.1 C819.1 C820.1 C821.1 U802.A4(VD) U802.B4(VD) U802.C4(VD)
N$32: R806.2 U802.E3(FSET)
N$36: R808.1 U803.F1(ISETB) U803.F2(ISETA)
N$39: TP810.P$1 U803.H4(SW)
N$41: C828.1 C829.1 U803.A4(VD) U803.B4(VD) U803.C4(VD)
V12: C801.P C802.1 C803.1 C812.P C813.1 C814.1 C823.1 C824.1 U801.A1(VIN) U801.A2(VIN) U801.A3(VIN) U801.B3(VIN) U801.C3(SVIN) U802.A1(VIN) U802.A2(VIN) U802.A3(VIN) U802.B3(VIN) U802.C3(SVIN) U803.A1(VIN) U803.A2(VIN) U803.A3(VIN) U803.B3(VIN) U803.C3(SVIN) ; also sheet 2,6,7,9
VN3P4: C824.2 C825.2 C826.2 C827.2 C829.2 C830.2 R808.2 TP807.P$1 U803.A5(VOUT-) U803.B5(VOUT-) U803.C2(VOUT-) U803.C5(VOUT-) U803.D5(VOUT-) U803.E4(SVOUT-) U803.E5(VOUT-) U803.F5(VOUT-) U803.G2(SVOUT-) U803.G4(VOUT-) U803.G5(VOUT-) U803.H2(SVOUT-) U803.H3(VOUT-) U803.H5(VOUT-) U803.J3(VOUT-) U803.J4(VOUT-) U803.J5(VOUT-) U803.K4(VOUT-) U803.K5(VOUT-) U803.L4(VOUT-) U803.L5(VOUT-) ; also sheet 4,5
VN3P4_EN: U803.F4(RUN) ; also sheet 3
VN22: C803.2 C804.2 C805.2 C806.2 C809.2 C810.2 C811.2 C814.2 C815.2 C816.2 C817.2 C820.2 C821.2 C822.2 R802.1 R803.2 R806.1 TP801.P$1 U801.A5(VOUT-) U801.B5(VOUT-) U801.C2(VOUT-) U801.C5(VOUT-) U801.D5(VOUT-) U801.E4(SVOUT-) U801.E5(VOUT-) U801.F5(VOUT-) U801.G2(SVOUT-) U801.G4(VOUT-) U801.G5(VOUT-) U801.H2(SVOUT-) U801.H3(VOUT-) U801.H5(VOUT-) U801.J3(VOUT-) U801.J4(VOUT-) U801.J5(VOUT-) U801.K4(VOUT-) U801.K5(VOUT-) U801.L4(VOUT-) U801.L5(VOUT-) U802.A5(VOUT-) U802.B5(VOUT-) U802.C2(VOUT-) U802.C5(VOUT-) U802.D5(VOUT-) U802.E4(SVOUT-) U802.E5(VOUT-) U802.F5(VOUT-) U802.G2(SVOUT-) U802.G4(VOUT-) U802.G5(VOUT-) U802.H2(SVOUT-) U802.H3(VOUT-) U802.H5(VOUT-) U802.J3(VOUT-) U802.J4(VOUT-) U802.J5(VOUT-) U802.K4(VOUT-) U802.K5(VOUT-) U802.L4(VOUT-) U802.L5(VOUT-) ; also sheet 4
VN22_CLKA: TP804.P$1 U801.B1(CLKIN) ; also sheet 3
VN22_CLKB: TP805.P$1 U802.B1(CLKIN) ; also sheet 3
VN22_EN: R804.1 U801.F4(RUN) U802.F4(RUN) ; also sheet 3
Unconnected: U801.D1(PGOOD) U801.D2(PGDFB) U801.H4(SW) U802.D1(PGOOD) U802.D2(PGDFB) U802.J6(TEMP+) U802.J7(TEMP-) U803.B1(CLKIN) U803.D1(PGOOD) U803.D2(PGDFB) U803.E3(FSET)

### Notes on the sheet
- Negative Voltage Regulators
- nominal: 2*-50e-6*220e3 = 22.0
- nominal: -50e-6*68e3 = 3.40

## Sheet 9 of 9: Misc Power
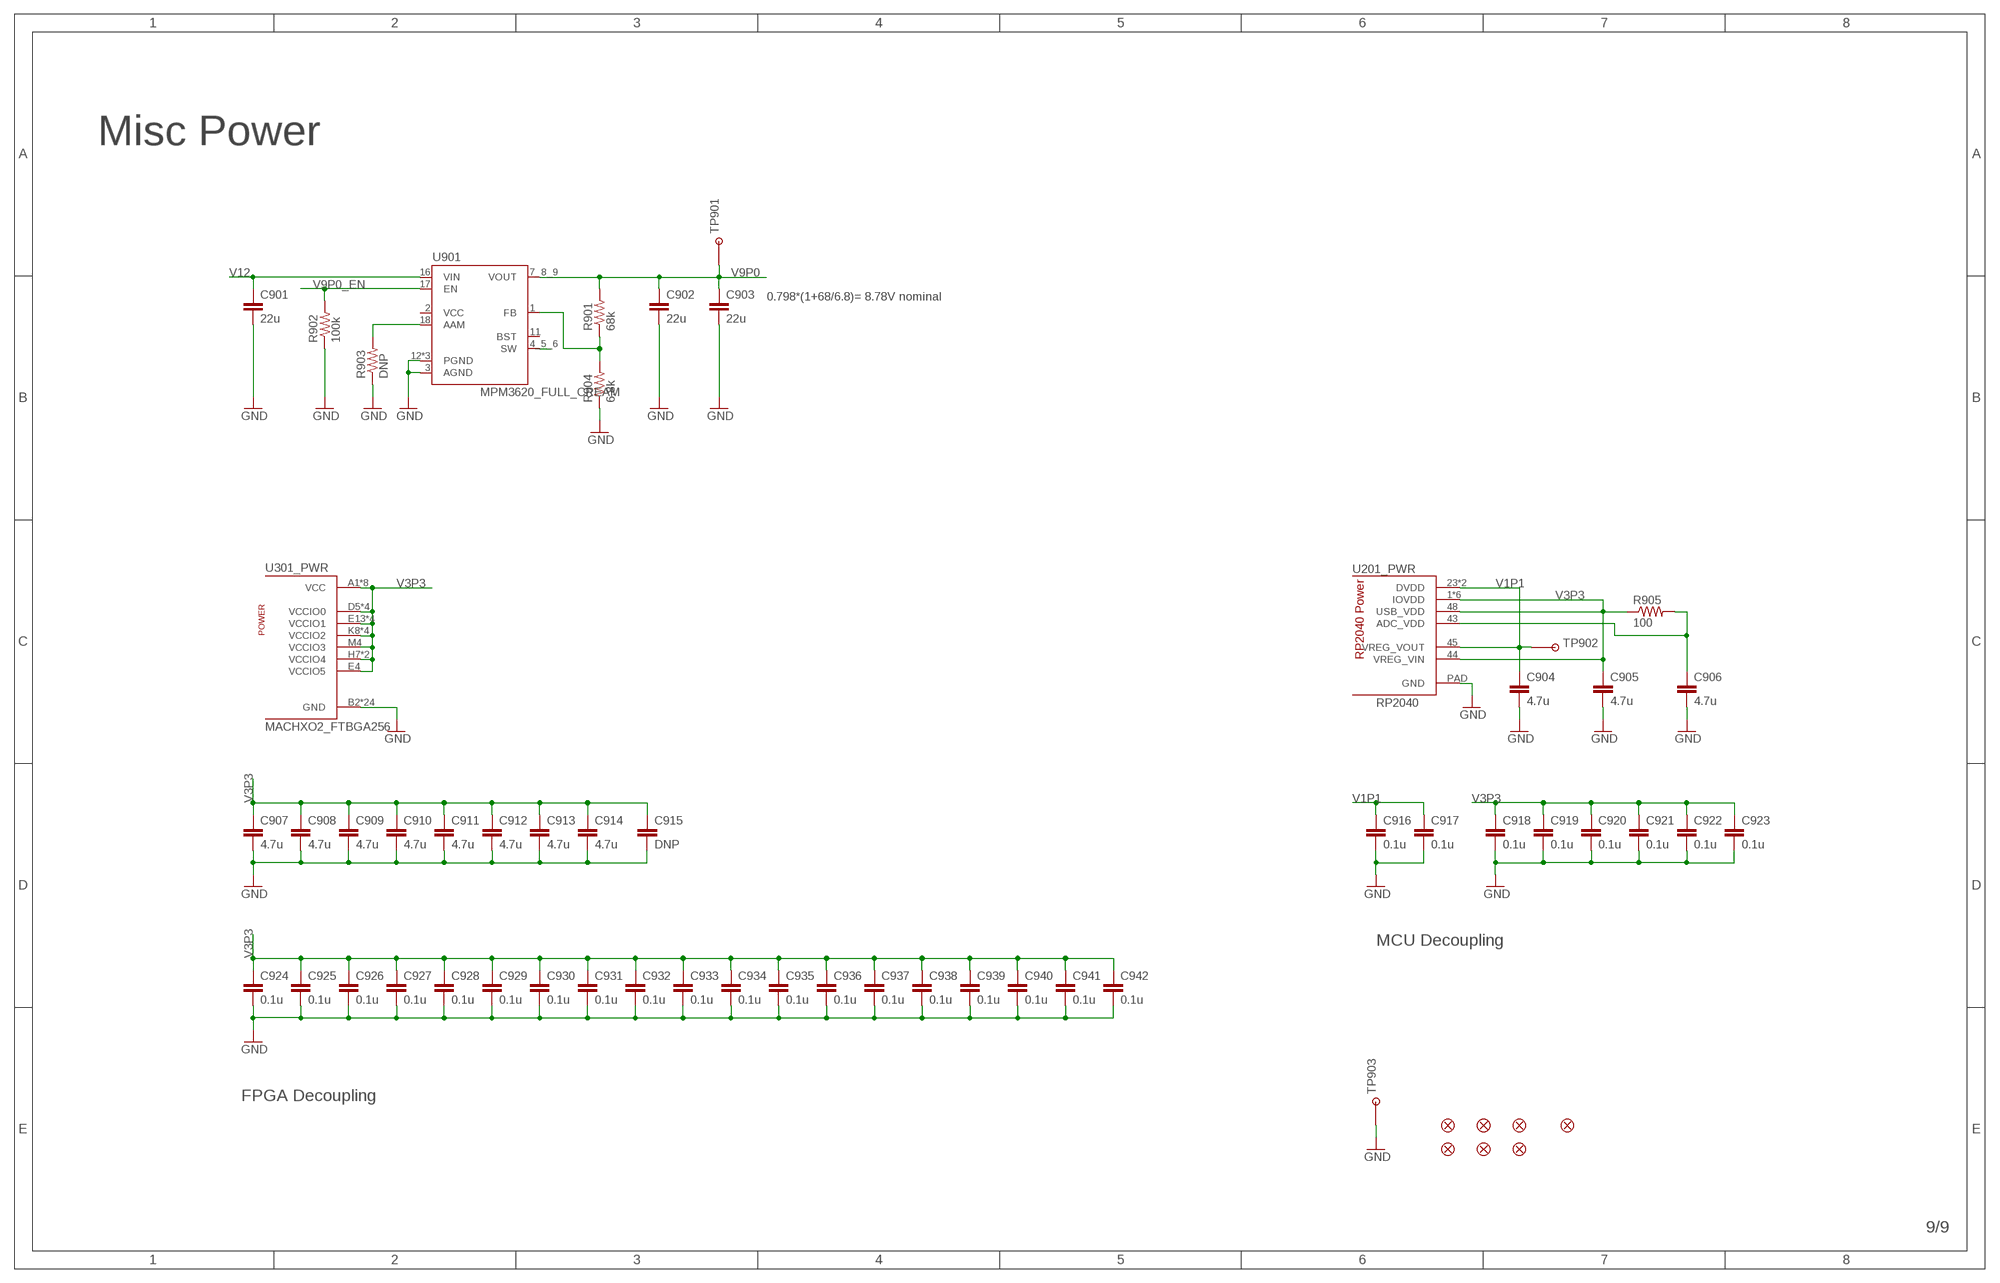
[diagram p8: schematic, sheet 9]

### Parts
C901  22u  CAP0805-CAP  [0805-CAP]
C902  22u  CAP0805-CAP  [0805-CAP]
C903  22u  CAP0805-CAP  [0805-CAP]
C904  4.7u  CAP0402-CAP  [0402-CAP]
C905  4.7u  CAP0402-CAP  [0402-CAP]
C906  4.7u  CAP0402-CAP  [0402-CAP]
C907  4.7u  CAP0402-CAP  [0402-CAP]
C908  4.7u  CAP0402-CAP  [0402-CAP]
C909  4.7u  CAP0402-CAP  [0402-CAP]
C910  4.7u  CAP0402-CAP  [0402-CAP]
C911  4.7u  CAP0402-CAP  [0402-CAP]
C912  4.7u  CAP0402-CAP  [0402-CAP]
C913  4.7u  CAP0402-CAP  [0402-CAP]
C914  4.7u  CAP0402-CAP  [0402-CAP]
C915  DNP  CAP0805-CAP  [0805-CAP]
C916  0.1u  CAP0402-CAP  [0402-CAP]
C917  0.1u  CAP0402-CAP  [0402-CAP]
C918  0.1u  CAP0402-CAP  [0402-CAP]
C919  0.1u  CAP0402-CAP  [0402-CAP]
C920  0.1u  CAP0402-CAP  [0402-CAP]
C921  0.1u  CAP0402-CAP  [0402-CAP]
C922  0.1u  CAP0402-CAP  [0402-CAP]
C923  0.1u  CAP0402-CAP  [0402-CAP]
C924  0.1u  CAP0402-CAP  [0402-CAP]
C925  0.1u  CAP0402-CAP  [0402-CAP]
C926  0.1u  CAP0402-CAP  [0402-CAP]
C927  0.1u  CAP0402-CAP  [0402-CAP]
C928  0.1u  CAP0402-CAP  [0402-CAP]
C929  0.1u  CAP0402-CAP  [0402-CAP]
C930  0.1u  CAP0402-CAP  [0402-CAP]
C931  0.1u  CAP0402-CAP  [0402-CAP]
C932  0.1u  CAP0402-CAP  [0402-CAP]
C933  0.1u  CAP0402-CAP  [0402-CAP]
C934  0.1u  CAP0402-CAP  [0402-CAP]
C935  0.1u  CAP0402-CAP  [0402-CAP]
C936  0.1u  CAP0402-CAP  [0402-CAP]
C937  0.1u  CAP0402-CAP  [0402-CAP]
C938  0.1u  CAP0402-CAP  [0402-CAP]
C939  0.1u  CAP0402-CAP  [0402-CAP]
C940  0.1u  CAP0402-CAP  [0402-CAP]
C941  0.1u  CAP0402-CAP  [0402-CAP]
C942  0.1u  CAP0402-CAP  [0402-CAP]
FID901  FIDUCIALUFIDUCIAL  [MICRO-FIDUCIAL]
FID902  FIDUCIALUFIDUCIAL  [MICRO-FIDUCIAL]
FID903  FIDUCIALUFIDUCIAL  [MICRO-FIDUCIAL]
FID904  FIDUCIALUFIDUCIAL  [MICRO-FIDUCIAL]
FID905  FIDUCIALUFIDUCIAL  [MICRO-FIDUCIAL]
FID906  FIDUCIALUFIDUCIAL  [MICRO-FIDUCIAL]
FID907  FIDUCIALUFIDUCIAL  [MICRO-FIDUCIAL]
R901  68k  RESISTOR0402-RES  [0402-RES]
R902  100k  RESISTOR0402-RES  [0402-RES]
R903  DNP  RESISTOR0402-RES  [0402-RES]
R904  6.8k  RESISTOR0402-RES  [0402-RES]
R905  100  RESISTOR0402-RES  [0402-RES]
TP901  TESTPOINT_ROUND  [TESTPAD_ROUND]
TP902  TESTPOINT_ROUND  [TESTPAD_ROUND]
TP903  TESTPOINTTUR  [TURRET]
U901  MPM3620_FULL_CREAM  [QFN-20-MPS_FULL_CREAM]

### Nets
GND: C901.2 C902.2 C903.2 C904.2 C905.2 C906.2 C907.2 C908.2 C909.2 C910.2 C911.2 C912.2 C913.2 C914.2 C915.2 C916.2 C917.2 C918.2 C919.2 C920.2 C921.2 C922.2 C923.2 C924.2 C925.2 C926.2 C927.2 C928.2 C929.2 C930.2 C931.2 C932.2 C933.2 C934.2 C935.2 C936.2 C937.2 C938.2 C939.2 C940.2 C941.2 C942.2 R902.1 R903.1 R904.1 TP903.P$1 U201.PAD(_PWR:GND) U301.B2(_PWR:GND) U301.B15(_PWR:GND) U301.C3(_PWR:GND) U301.C14(_PWR:GND) U301.D4(_PWR:GND) U301.D13(_PWR:GND) U301.E5(_PWR:GND) U301.E12(_PWR:GND) U301.F6(_PWR:GND) U301.F11(_PWR:GND) U301.H8(_PWR:GND) U301.H9(_PWR:GND) U301.J8(_PWR:GND) U301.J9(_PWR:GND) U301.L6(_PWR:GND) U301.L11(_PWR:GND) U301.M5(_PWR:GND) U301.M12(_PWR:GND) U301.N4(_PWR:GND) U301.N13(_PWR:GND) U301.P3(_PWR:GND) U301.P14(_PWR:GND) U301.R2(_PWR:GND) U301.R15(_PWR:GND) U901.3(AGND) U901.12(PGND) U901.13(PGND) U901.14(PGND) ; also sheet 1,2,3,4,5,6,7,8
N$10: U901.4_5_6(SW)
N$43: C906.1 R905.2 U201.43(_PWR:ADC_VDD)
N$64: R903.2 U901.18(AAM)
N$67: R901.1 R904.2 U901.1(FB)
V1P1: C904.1 C916.1 C917.1 TP902.P$1 U201.23(_PWR:DVDD) U201.45(_PWR:VREG_VOUT) U201.50(_PWR:DVDD)
V3P3: C905.1 C907.1 C908.1 C909.1 C910.1 C911.1 C912.1 C913.1 C914.1 C915.1 C918.1 C919.1 C920.1 C921.1 C922.1 C923.1 C924.1 C925.1 C926.1 C927.1 C928.1 C929.1 C930.1 C931.1 C932.1 C933.1 C934.1 C935.1 C936.1 C937.1 C938.1 C939.1 C940.1 C941.1 C942.1 R905.1 U201.1(_PWR:IOVDD) U201.10(_PWR:IOVDD) U201.22(_PWR:IOVDD) U201.33(_PWR:IOVDD) U201.42(_PWR:IOVDD) U201.44(_PWR:VREG_VIN) U201.48(_PWR:USB_VDD) U201.49(_PWR:IOVDD) U301.A1(_PWR:VCC) U301.A16(_PWR:VCC) U301.D5(_PWR:VCCIO0) U301.D12(_PWR:VCCIO0) U301.E4(_PWR:VCCIO5) U301.E13(_PWR:VCCIO1) U301.G7(_PWR:VCC) U301.G8(_PWR:VCCIO0) U301.G9(_PWR:VCCIO0) U301.G10(_PWR:VCC) U301.H7(_PWR:VCCIO4) U301.H10(_PWR:VCCIO1) U301.J7(_PWR:VCCIO4) U301.J10(_PWR:VCCIO1) U301.K7(_PWR:VCC) U301.K8(_PWR:VCCIO2) U301.K9(_PWR:VCCIO2) U301.K10(_PWR:VCC) U301.M4(_PWR:VCCIO3) U301.M13(_PWR:VCCIO1) U301.N5(_PWR:VCCIO2) U301.N12(_PWR:VCCIO2) U301.T1(_PWR:VCC) U301.T16(_PWR:VCC) ; also sheet 2,3,5,6,7
V9P0: C902.1 C903.1 R901.2 TP901.P$1 U901.7_8_9(VOUT) ; also sheet 4
V9P0_EN: R902.2 U901.17(EN) ; also sheet 3
V12: C901.1 U901.16(VIN) ; also sheet 2,6,7,8
Unconnected: U901.2(VCC) U901.11(BST)

### Notes on the sheet
- Misc Power
- 0.798*(1+68/6.8)= 8.78V nominal
- MCU Decoupling
- FPGA Decoupling